# Altium project HHL_Control_board_Rev1.PrjPcb (part 1 of 2)
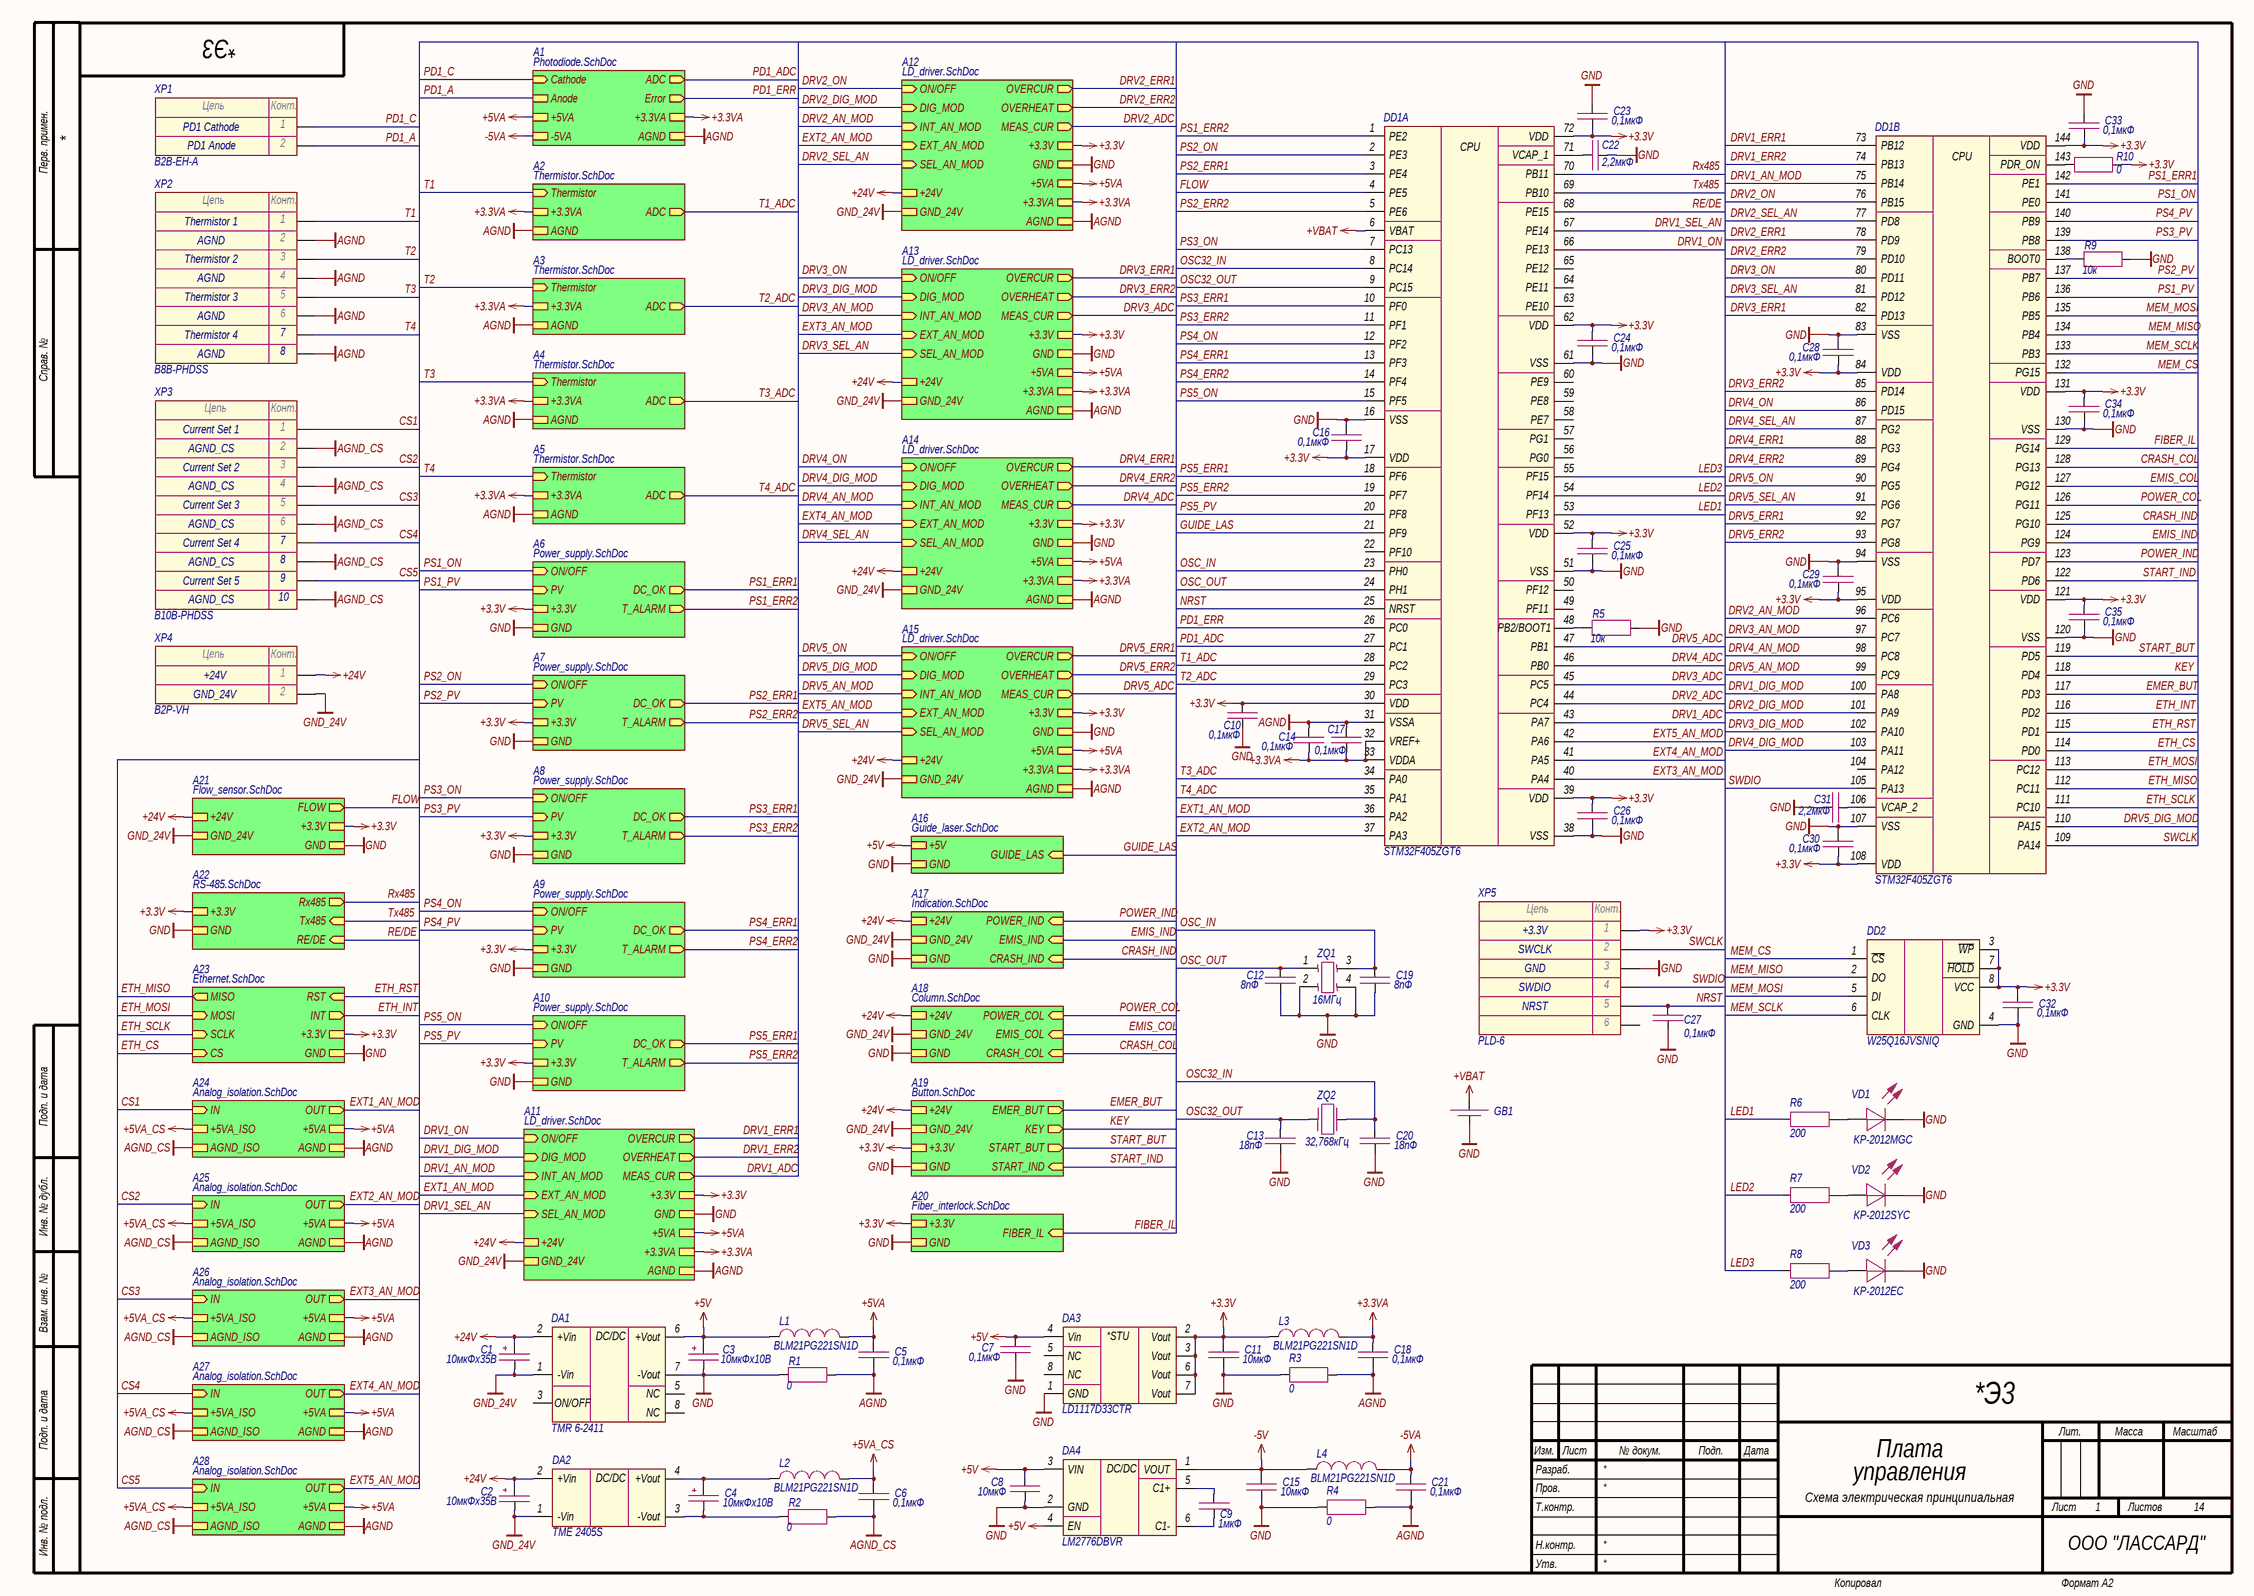
[diagram p0: Main.SchDoc]
14 sheets, 627 parts. Net scope: strictly hierarchical (ports join the sheet entries above them; power ports are local).
Board file: PCB1.PcbDoc
Sheets:
  Main.SchDoc
    A1 = Photodiode.SchDoc
    A5 = Thermistor.SchDoc
    A2 = Thermistor.SchDoc
    A3 = Thermistor.SchDoc
    A4 = Thermistor.SchDoc
    A6 = Power_supply.SchDoc
    A7 = Power_supply.SchDoc
    A8 = Power_supply.SchDoc
    A9 = Power_supply.SchDoc
    A10 = Power_supply.SchDoc
    A11 = LD_driver.SchDoc
    A12 = LD_driver.SchDoc
    A13 = LD_driver.SchDoc
    A14 = LD_driver.SchDoc
    A15 = LD_driver.SchDoc
    A16 = Guide_laser.SchDoc
    A17 = Indication.SchDoc
    A18 = Column.SchDoc
    A19 = Button.SchDoc
    A20 = Fiber_interlock.SchDoc
    A21 = Flow_sensor.SchDoc
    A22 = RS-485.SchDoc
    A23 = Ethernet.SchDoc
    A24 = Analog_isolation.SchDoc
    A25 = Analog_isolation.SchDoc
    A26 = Analog_isolation.SchDoc
    A27 = Analog_isolation.SchDoc
    A28 = Analog_isolation.SchDoc

## Sheet Main.SchDoc: Плата
size 594 x 420 mm; CompanyName: ООО "ЛАССАРД"; Address1: Address1; Address2: Address2; Address3: Address3; Address4: Address4; DocumentNumber: *Э3; SheetNumber: 1; SheetTotal: 14; Title2str: управления; DocumentType: Схема электрическая принципиальная

### Parts
C1  10мкФх35B  [CAP_C]
C2  10мкФх35B  [CAP_C]
C3  10мкФх10B  [CAP_A]
C4  10мкФх10B  [CAP_A]
C5  0,1мкФ  [CAP_0603]
C6  0,1мкФ  [CAP_0603]
C7  0,1мкФ  [CAP_0603]
C8  10мкФ  [CAP_0603]
C9  1мкФ  [CAP_0603]
C10  0,1мкФ  [CAP_0603]
C11  10мкФ  [CAP_0603]
C12  8пФ  [CAP_0603]
C13  18пФ  [CAP_0603]
C14  0,1мкФ  [CAP_0603]
C15  10мкФ  [CAP_0603]
C16  0,1мкФ  [CAP_0603]
C17  0,1мкФ  [CAP_0603]
C18  0,1мкФ  [CAP_0603]
C19  8пФ  [CAP_0603]
C20  18пФ  [CAP_0603]
C21  0,1мкФ  [CAP_0603]
C22  2,2мкФ  [CAP_0603]
C23  0,1мкФ  [CAP_0603]
C24  0,1мкФ  [CAP_0603]
C25  0,1мкФ  [CAP_0603]
C26  0,1мкФ  [CAP_0603]
C27  0,1мкФ  [CAP_0603]
C28  0,1мкФ  [CAP_0603]
C29  0,1мкФ  [CAP_0603]
C30  0,1мкФ  [CAP_0603]
C31  2,2мкФ  [CAP_0603]
C32  0,1мкФ  [CAP_0603]
C33  0,1мкФ  [CAP_0603]
C34  0,1мкФ  [CAP_0603]
C35  0,1мкФ  [CAP_0603]
DA1  TMR 6-2411  [TMR3 (SIP-8)]
DA2  TME 2405S  [TME (SIP-4)]
DA3  LD1117D33CTR  [SOIC-8]
DA4  LM2776DBVR  [SOT-23-6]
DD1  STM32F405ZGT6  [LQFP-144]  (parts A,B of 2)
DD2  W25Q16JVSNIQ  [SOIC-8]
GB1  DS1092-12-N8S  [DS1092-12-N8S]  (value not drawn)
L1  BLM21PG221SN1D  [IND_0805]
L2  BLM21PG221SN1D  [IND_0805]
L3  BLM21PG221SN1D  [IND_0805]
L4  BLM21PG221SN1D  [IND_0805]
R1  0  [RES_0805]
R2  0  [RES_0805]
R3  0  [RES_0805]
R4  0  [RES_0805]
R5  10к  [RES_0603]
R6  200  [RES_0603]
R7  200  [RES_0603]
R8  200  [RES_0603]
R9  10к  [RES_0603]
R10  0  [RES_0603]
VD1  KP-2012MGC  [LED_0805]
VD2  KP-2012SYC  [LED_0805]
VD3  KP-2012EC  [LED_0805]
XP1  B2B-EH-A  [B2B-EH-A]
XP2  B8B-PHDSS  [B8B-PHDSS]
XP3  B10B-PHDSS  [B10B-PHDSS]
XP4  B2P-VH  [B2P-VH]
XP5  PLD-6  [PLD-6]
ZQ1  16МГц  [NX2520SA]
ZQ2  32,768кГц  [NX3215SA]

### Sub-sheets
A1 = Photodiode.SchDoc: ADC (out), Error (out), AGND, +5VA, +3.3VA, Anode, -5VA, Cathode (in)
A2 = Thermistor.SchDoc: Thermistor (in), +3.3VA, AGND, ADC (out)
A3 = Thermistor.SchDoc: Thermistor (in), +3.3VA, AGND, ADC (out)
A4 = Thermistor.SchDoc: Thermistor (in), +3.3VA, AGND, ADC (out)
A5 = Thermistor.SchDoc: Thermistor (in), +3.3VA, AGND, ADC (out)
A6 = Power_supply.SchDoc: ON/OFF (in), PV (in), +3.3V, GND, DC_OK (out), T_ALARM (out)
A7 = Power_supply.SchDoc: ON/OFF (in), PV (in), +3.3V, GND, DC_OK (out), T_ALARM (out)
A8 = Power_supply.SchDoc: ON/OFF (in), PV (in), +3.3V, GND, DC_OK (out), T_ALARM (out)
A9 = Power_supply.SchDoc: ON/OFF (in), PV (in), +3.3V, GND, DC_OK (out), T_ALARM (out)
A10 = Power_supply.SchDoc: ON/OFF (in), PV (in), +3.3V, GND, DC_OK (out), T_ALARM (out)
A11 = LD_driver.SchDoc: +3.3V, GND, OVERCUR (out), OVERHEAT (out), +24V, GND_24V, ON/OFF (in), DIG_MOD (in), INT_AN_MOD (in), EXT_AN_MOD (in), SEL_AN_MOD (in), MEAS_CUR (out), +5VA, +3.3VA, AGND
A12 = LD_driver.SchDoc: +3.3V, GND, OVERCUR (out), OVERHEAT (out), +24V, GND_24V, ON/OFF (in), DIG_MOD (in), INT_AN_MOD (in), EXT_AN_MOD (in), SEL_AN_MOD (in), MEAS_CUR (out), +5VA, +3.3VA, AGND
A13 = LD_driver.SchDoc: +3.3V, GND, OVERCUR (out), OVERHEAT (out), +24V, GND_24V, ON/OFF (in), DIG_MOD (in), INT_AN_MOD (in), EXT_AN_MOD (in), SEL_AN_MOD (in), MEAS_CUR (out), +5VA, +3.3VA, AGND
A14 = LD_driver.SchDoc: +3.3V, GND, OVERCUR (out), OVERHEAT (out), +24V, GND_24V, ON/OFF (in), DIG_MOD (in), INT_AN_MOD (in), EXT_AN_MOD (in), SEL_AN_MOD (in), MEAS_CUR (out), +5VA, +3.3VA, AGND
A15 = LD_driver.SchDoc: +3.3V, GND, OVERCUR (out), OVERHEAT (out), +24V, GND_24V, ON/OFF (in), DIG_MOD (in), INT_AN_MOD (in), EXT_AN_MOD (in), SEL_AN_MOD (in), MEAS_CUR (out), +5VA, +3.3VA, AGND
A16 = Guide_laser.SchDoc: GUIDE_LAS (in), +5V, GND
A17 = Indication.SchDoc: GND_24V, +24V, CRASH_IND (in), POWER_IND (in), EMIS_IND (in), GND
A18 = Column.SchDoc: GND_24V, +24V, CRASH_COL (in), POWER_COL (in), EMIS_COL (in), GND
A19 = Button.SchDoc: EMER_BUT (out), +24V, GND_24V, +3.3V, GND, KEY (out), START_BUT (out), START_IND (in)
A20 = Fiber_interlock.SchDoc: FIBER_IL (in), +3.3V, GND
A21 = Flow_sensor.SchDoc: FLOW (out), +24V, GND_24V, +3.3V, GND
A22 = RS-485.SchDoc: Rx485 (out), Tx485 (in), RE/DE (in), +3.3V, GND
A23 = Ethernet.SchDoc: MISO (out), RST (in), MOSI (in), INT (out), SCLK (in), CS (in), +3.3V, GND
A24 = Analog_isolation.SchDoc: IN (in), +5VA_ISO, AGND_ISO, OUT (out), AGND, +5VA
A25 = Analog_isolation.SchDoc: IN (in), +5VA_ISO, AGND_ISO, OUT (out), AGND, +5VA
A26 = Analog_isolation.SchDoc: IN (in), +5VA_ISO, AGND_ISO, OUT (out), AGND, +5VA
A27 = Analog_isolation.SchDoc: IN (in), +5VA_ISO, AGND_ISO, OUT (out), AGND, +5VA
A28 = Analog_isolation.SchDoc: IN (in), +5VA_ISO, AGND_ISO, OUT (out), +5VA, AGND

### Nets
+3.3V: C10.1 C11.1 C16.2 C23.2 C24.1 C25.1 C26.1 C28.2 C29.2 C30.2 C32.1 C33.2 C34.1 C35.1 DA3.2(Vout) DA3.3(Vout) DA3.6(Vout) DA3.7(Vout) DD1.17(VDD) DD1.30(VDD) DD1.39(VDD) DD1.52(VDD) DD1.62(VDD) DD1.72(VDD) DD1.84(VDD) DD1.95(VDD) DD1.108(VDD) DD1.121(VDD) DD1.131(VDD) DD1.144(VDD) DD2.3(~{WP}) DD2.7(~{HOLD}) DD2.8(VCC) L3.1 R10.2 XP5.1 ; sheet A6/+3.3V, sheet A7/+3.3V, sheet A8/+3.3V, sheet A9/+3.3V, sheet A10/+3.3V, sheet A11/+3.3V, sheet A12/+3.3V, sheet A13/+3.3V, sheet A14/+3.3V, sheet A15/+3.3V, sheet A19/+3.3V, sheet A20/+3.3V, sheet A21/+3.3V, sheet A22/+3.3V, sheet A23/+3.3V
+3.3VA: C14.2 C17.2 C18.1 DD1.32(VREF+) DD1.33(VDDA) L3.2 ; sheet A1/+3.3VA, sheet A5/+3.3VA, sheet A2/+3.3VA, sheet A3/+3.3VA, sheet A4/+3.3VA, sheet A11/+3.3VA, sheet A12/+3.3VA, sheet A13/+3.3VA, sheet A14/+3.3VA, sheet A15/+3.3VA
+5V: C3.1 C7.2 C8.1 DA1.6(+Vout) DA3.4(Vin) DA4.3(VIN) DA4.4(EN) L1.1 ; sheet A16/+5V
+5VA: C5.1 L1.2 ; sheet A1/+5VA, sheet A11/+5VA, sheet A12/+5VA, sheet A13/+5VA, sheet A14/+5VA, sheet A15/+5VA, sheet A24/+5VA, sheet A25/+5VA, sheet A26/+5VA, sheet A27/+5VA, sheet A28/+5VA
+5VA_CS: C6.1 L2.2 ; sheet A24/+5VA_ISO, sheet A25/+5VA_ISO, sheet A26/+5VA_ISO, sheet A27/+5VA_ISO, sheet A28/+5VA_ISO
+24V: C1.1 C2.1 DA1.2(+Vin) DA2.2(+Vin) XP4.1 ; sheet A11/+24V, sheet A12/+24V, sheet A13/+24V, sheet A14/+24V, sheet A15/+24V, sheet A17/+24V, sheet A18/+24V, sheet A19/+24V, sheet A21/+24V
+VBAT: DD1.6(VBAT) GB1.2
-5V: C15.1 DA4.1(VOUT) L4.1
-5VA: C21.1 L4.2 ; sheet A1/-5VA
AGND: C5.2 C14.1 C17.1 C18.2 C21.2 DD1.31(VSSA) R1.2 R3.2 R4.2 XP2.2 XP2.4 XP2.6 XP2.8 ; sheet A1/AGND, sheet A5/AGND, sheet A2/AGND, sheet A3/AGND, sheet A4/AGND, sheet A11/AGND, sheet A12/AGND, sheet A13/AGND, sheet A14/AGND, sheet A15/AGND, sheet A24/AGND, sheet A25/AGND, sheet A26/AGND, sheet A27/AGND, sheet A28/AGND
AGND_CS: C6.2 R2.2 XP3.2 XP3.4 XP3.6 XP3.8 XP3.10 ; sheet A24/AGND_ISO, sheet A25/AGND_ISO, sheet A26/AGND_ISO, sheet A27/AGND_ISO, sheet A28/AGND_ISO
GND: C3.2 C7.1 C8.2 C10.2 C11.2 C12.2 C13.2 C15.2 C16.1 C19.2 C20.2 C22.2 C23.1 C24.2 C25.2 C26.2 C27.2 C28.1 C29.1 C30.1 C31.2 C32.2 C33.1 C34.2 C35.2 DA1.7(-Vout) DA3.1(GND) DA4.2(GND) DD1.16(VSS) DD1.38(VSS) DD1.51(VSS) DD1.61(VSS) DD1.83(VSS) DD1.94(VSS) DD1.107(VSS) DD1.120(VSS) DD1.130(VSS) DD2.4(GND) GB1.1 R1.1 R3.1 R4.1 R5.2 R9.2 VD1.2(C) VD2.2(C) VD3.2(C) XP5.3 ZQ1.2 ZQ1.4 ; sheet A6/GND, sheet A7/GND, sheet A8/GND, sheet A9/GND, sheet A10/GND, sheet A11/GND, sheet A12/GND, sheet A13/GND, sheet A14/GND, sheet A15/GND, sheet A16/GND, sheet A17/GND, sheet A18/GND, sheet A19/GND, sheet A20/GND, sheet A21/GND, sheet A22/GND, sheet A23/GND
GND_24V: C1.2 C2.2 DA1.1(-Vin) DA2.1(-Vin) XP4.2 ; sheet A11/GND_24V, sheet A12/GND_24V, sheet A13/GND_24V, sheet A14/GND_24V, sheet A15/GND_24V, sheet A17/GND_24V, sheet A18/GND_24V, sheet A19/GND_24V, sheet A21/GND_24V
CRASH_COL: DD1.128(PG13) ; sheet A18/CRASH_COL
CRASH_IND: DD1.125(PG10) ; sheet A17/CRASH_IND
CS1: XP3.1 ; sheet A24/IN
CS2: XP3.3 ; sheet A25/IN
CS3: XP3.5 ; sheet A26/IN
CS4: XP3.7 ; sheet A27/IN
CS5: XP3.9 ; sheet A28/IN
DRV1_ADC: DD1.43(PA7) ; sheet A11/MEAS_CUR
DRV1_AN_MOD: DD1.75(PB14) ; sheet A11/INT_AN_MOD
DRV1_DIG_MOD: DD1.100(PA8) ; sheet A11/DIG_MOD
DRV1_ERR1: DD1.73(PB12) ; sheet A11/OVERCUR
DRV1_ERR2: DD1.74(PB13) ; sheet A11/OVERHEAT
DRV1_ON: DD1.66(PE13) ; sheet A11/ON/OFF
DRV1_SEL_AN: DD1.67(PE14) ; sheet A11/SEL_AN_MOD
DRV2_ADC: DD1.44(PC4) ; sheet A12/MEAS_CUR
DRV2_AN_MOD: DD1.96(PC6) ; sheet A12/INT_AN_MOD
DRV2_DIG_MOD: DD1.101(PA9) ; sheet A12/DIG_MOD
DRV2_ERR1: DD1.78(PD9) ; sheet A12/OVERCUR
DRV2_ERR2: DD1.79(PD10) ; sheet A12/OVERHEAT
DRV2_ON: DD1.76(PB15) ; sheet A12/ON/OFF
DRV2_SEL_AN: DD1.77(PD8) ; sheet A12/SEL_AN_MOD
DRV3_ADC: DD1.45(PC5) ; sheet A13/MEAS_CUR
DRV3_AN_MOD: DD1.97(PC7) ; sheet A13/INT_AN_MOD
DRV3_DIG_MOD: DD1.102(PA10) ; sheet A13/DIG_MOD
DRV3_ERR1: DD1.82(PD13) ; sheet A13/OVERCUR
DRV3_ERR2: DD1.85(PD14) ; sheet A13/OVERHEAT
DRV3_ON: DD1.80(PD11) ; sheet A13/ON/OFF
DRV3_SEL_AN: DD1.81(PD12) ; sheet A13/SEL_AN_MOD
DRV4_ADC: DD1.46(PB0) ; sheet A14/MEAS_CUR
DRV4_AN_MOD: DD1.98(PC8) ; sheet A14/INT_AN_MOD
DRV4_DIG_MOD: DD1.103(PA11) ; sheet A14/DIG_MOD
DRV4_ERR1: DD1.88(PG3) ; sheet A14/OVERCUR
DRV4_ERR2: DD1.89(PG4) ; sheet A14/OVERHEAT
DRV4_ON: DD1.86(PD15) ; sheet A14/ON/OFF
DRV4_SEL_AN: DD1.87(PG2) ; sheet A14/SEL_AN_MOD
DRV5_ADC: DD1.47(PB1) ; sheet A15/MEAS_CUR
DRV5_AN_MOD: DD1.99(PC9) ; sheet A15/INT_AN_MOD
DRV5_DIG_MOD: DD1.110(PA15) ; sheet A15/DIG_MOD
DRV5_ERR1: DD1.92(PG7) ; sheet A15/OVERCUR
DRV5_ERR2: DD1.93(PG8) ; sheet A15/OVERHEAT
DRV5_ON: DD1.90(PG5) ; sheet A15/ON/OFF
DRV5_SEL_AN: DD1.91(PG6) ; sheet A15/SEL_AN_MOD
EMER_BUT: DD1.117(PD3) ; sheet A19/EMER_BUT
EMIS_COL: DD1.127(PG12) ; sheet A18/EMIS_COL
EMIS_IND: DD1.124(PG9) ; sheet A17/EMIS_IND
ETH_CS: DD1.114(PD0) ; sheet A23/CS
ETH_INT: DD1.116(PD2) ; sheet A23/INT
ETH_MISO: DD1.112(PC11) ; sheet A23/MISO
ETH_MOSI: DD1.113(PC12) ; sheet A23/MOSI
ETH_RST: DD1.115(PD1) ; sheet A23/RST
ETH_SCLK: DD1.111(PC10) ; sheet A23/SCLK
EXT1_AN_MOD: DD1.36(PA2) ; sheet A11/EXT_AN_MOD, sheet A24/OUT
EXT2_AN_MOD: DD1.37(PA3) ; sheet A12/EXT_AN_MOD, sheet A25/OUT
EXT3_AN_MOD: DD1.40(PA4) ; sheet A13/EXT_AN_MOD, sheet A26/OUT
EXT4_AN_MOD: DD1.41(PA5) ; sheet A14/EXT_AN_MOD, sheet A27/OUT
EXT5_AN_MOD: DD1.42(PA6) ; sheet A15/EXT_AN_MOD, sheet A28/OUT
FIBER_IL: DD1.129(PG14) ; sheet A20/FIBER_IL
FLOW: DD1.4(PE5) ; sheet A21/FLOW
GUIDE_LAS: DD1.21(PF9) ; sheet A16/GUIDE_LAS
KEY: DD1.118(PD4) ; sheet A19/KEY
LED1: DD1.53(PF13) R6.1
LED2: DD1.54(PF14) R7.1
LED3: DD1.55(PF15) R8.1
MEM_CS: DD1.132(PG15) DD2.1(~{CS})
MEM_MISO: DD1.134(PB4) DD2.2(DO)
MEM_MOSI: DD1.135(PB5) DD2.5(DI)
MEM_SCLK: DD1.133(PB3) DD2.6(CLK)
NRST: C27.1 DD1.25(NRST) XP5.5
OSC32_IN: C20.1 DD1.8(PC14) ZQ2.2
OSC32_OUT: C13.1 DD1.9(PC15) ZQ2.1
OSC_IN: C19.1 DD1.23(PH0) ZQ1.3
OSC_OUT: C12.1 DD1.24(PH1) ZQ1.1
PD1_A: XP1.2 ; sheet A1/Anode
PD1_ADC: DD1.27(PC1) ; sheet A1/ADC
PD1_C: XP1.1 ; sheet A1/Cathode
PD1_ERR: DD1.26(PC0) ; sheet A1/Error
POWER_COL: DD1.126(PG11) ; sheet A18/POWER_COL
POWER_IND: DD1.123(PD7) ; sheet A17/POWER_IND
PS1_ERR1: DD1.142(PE1) ; sheet A6/DC_OK
PS1_ERR2: DD1.1(PE2) ; sheet A6/T_ALARM
PS1_ON: DD1.141(PE0) ; sheet A6/ON/OFF
PS1_PV: DD1.136(PB6) ; sheet A6/PV
PS2_ERR1: DD1.3(PE4) ; sheet A7/DC_OK
PS2_ERR2: DD1.5(PE6) ; sheet A7/T_ALARM
PS2_ON: DD1.2(PE3) ; sheet A7/ON/OFF
PS2_PV: DD1.137(PB7) ; sheet A7/PV
PS3_ERR1: DD1.10(PF0) ; sheet A8/DC_OK
PS3_ERR2: DD1.11(PF1) ; sheet A8/T_ALARM
PS3_ON: DD1.7(PC13) ; sheet A8/ON/OFF
PS3_PV: DD1.139(PB8) ; sheet A8/PV
PS4_ERR1: DD1.13(PF3) ; sheet A9/DC_OK
PS4_ERR2: DD1.14(PF4) ; sheet A9/T_ALARM
PS4_ON: DD1.12(PF2) ; sheet A9/ON/OFF
PS4_PV: DD1.140(PB9) ; sheet A9/PV
PS5_ERR1: DD1.18(PF6) ; sheet A10/DC_OK
PS5_ERR2: DD1.19(PF7) ; sheet A10/T_ALARM
PS5_ON: DD1.15(PF5) ; sheet A10/ON/OFF
PS5_PV: DD1.20(PF8) ; sheet A10/PV
RE/DE: DD1.68(PE15) ; sheet A22/RE/DE
Rx485: DD1.70(PB11) ; sheet A22/Rx485
START_BUT: DD1.119(PD5) ; sheet A19/START_BUT
START_IND: DD1.122(PD6) ; sheet A19/START_IND
SWCLK: DD1.109(PA14) XP5.2
SWDIO: DD1.105(PA13) XP5.4
T1: XP2.1 ; sheet A2/Thermistor
T1_ADC: DD1.28(PC2) ; sheet A2/ADC
T2: XP2.3 ; sheet A3/Thermistor
T2_ADC: DD1.29(PC3) ; sheet A3/ADC
T3: XP2.5 ; sheet A4/Thermistor
T3_ADC: DD1.34(PA0) ; sheet A4/ADC
T4: XP2.7 ; sheet A5/Thermistor
T4_ADC: DD1.35(PA1) ; sheet A5/ADC
Tx485: DD1.69(PB10) ; sheet A22/Tx485
NetC4_1: C4.1 DA2.4(+Vout) L2.1
NetC4_2: C4.2 DA2.3(-Vout) R2.1
NetC9_1: C9.1 DA4.5(C1+)
NetC9_2: C9.2 DA4.6(C1-)
NetC22_1: C22.1 DD1.71(VCAP_1)
NetC31_1: C31.1 DD1.106(VCAP_2)
NetDD1_48: DD1.48(PB2/BOOT1) R5.1
NetDD1_138: DD1.138(BOOT0) R9.1
NetDD1_143: DD1.143(PDR_ON) R10.1
NetR6_2: R6.2 VD1.1(A)
NetR7_2: R7.2 VD2.1(A)
NetR8_2: R8.2 VD3.1(A)

Not connected (* = marked no-connect by the designer): DA1 3(ON/OFF) 5(NC) 8(NC); DA3 5(NC) 8(NC); DD1 22(PF10) 49(PF11) 50(PF12) 56(PG0) 57(PG1) 58(PE7) 59(PE8) 60(PE9) 63(PE10) 64(PE11) 65(PE12) 104(PA12); XP5 6

### Notes on the sheet
- PD1 Cathode
- PD1 Anode
- Thermistor 1
- AGND
- Thermistor 2
- Thermistor 3
- Thermistor 4
- Current Set 1
- AGND_CS
- Current Set 2
- Current Set 3
- Current Set 4
- Current Set 5
- +24V
- GND_24V
- +3.3V
- GND
- SWDIO
- SWCLK
- NRST
- Перв. примен.
- Справ. №
- Подп. и дата
- Инв. № дубл.
- Взам. инв. №
- Разраб.
- Изм.
- Лист
- № докум.
- Подп.
- Дата
- Лит.
- Масса
- Масштаб
- Пров.
- Т.контр.
- Листов
- Инв. № подл.
- Утв.
- Н.контр.
- Копировал
- Формат А2
- (in symbol Connector-2) Цепь; Конт.
- (in symbol Connector-8) Цепь; Конт.
- (in symbol Connector-10) Цепь; Конт.
- (in symbol LD1117D33) *STU
- (in symbol LM2776DBVR) DC/DC
- (in symbol STM32F405ZG, part A) CPU
- (in symbol STM32F405ZG, part B) CPU
- (in symbol TME) DC/DC
- (in symbol TMR3) DC/DC

### Library data of the parts
C1 C2 = Capacitor_Polar: Model: TECAP, 10 мкФ, 35 В, тип C, 10%; Value: 10мкФх35B; Document: *; Manufacturer: *
C3 C4 = Capacitor_Polar: Model: TECAP, 10 мкФ, 10 В, тип A, 10%; Value: 10мкФх10B; Document: *; Manufacturer: *
C5-C7 C10 C14 C16-C18 C21 C23-C30 C32-C35 = Capacitor: Manufacturer: Murata; Model: GRM188R71H104KA93D; Value: 0,1мкФ; Document: *
C8 C11 C15 = Capacitor: Manufacturer: Murata; Model: GRM188R61E106KA73D; Value: 10мкФ; Document: *
C9 = Capacitor: Manufacturer: Murata; Model: GRM188R61H105KAALD; Value: 1мкФ; Document: *
C12 C19 = Capacitor: Manufacturer: Yageo; Model: CC0603CRNPO9BN8R0; Value: 8пФ; Document: *
C13 C20 = Capacitor: Manufacturer: Murata; Model: GRM1885C1H180FA01D; Value: 18пФ; Document: *
C22 C31 = Capacitor: Manufacturer: Murata; Model: GRM188R61H225KE11D; Value: 2,2мкФ; Document: *
DA1 = TMR3: Manufacturer: Traco Power; Model: TMR 6-2411; Document: *
DA2 = TME: Manufacturer: Traco Power; Model: TME 2405S; Document: *
DA3 = LD1117D33: Manufacturer: STMicroelectronics; Model: LD1117D33CTR; Document: *
DA4 = LM2776DBVR: Manufacturer: Texas Instruments; Model: LM2776DBVR; Document: *
DD1 = STM32F405ZG: Manufacturer: STMicroelectronics; Model: STM32F405ZGT6; Document: *
DD2 = W25Q: Manufacturer: Winbond; Model: W25Q16JVSNIQ; Document: *
GB1 = Accumulator: Manufacturer: Connfly; Model: DS1092-12-N8S; Document: *
L1-L4 = Inductor: Manufacturer: Murata; Value: *; Model: BLM21PG221SN1D; Document: *
R1-R4 = Resistor: Manufacturer: Yageo; Model: RC0805FR-070RL; Value: 0; Document: *
R5 R9 = Resistor: Manufacturer: Yageo; Model: RC0603FR-0710KL; Value: 10к; Document: *
R6-R8 = Resistor: Manufacturer: Yageo; Model: RC0603FR-07200RL; Value: 200; Document: *
R10 = Resistor: Manufacturer: Yageo; Model: RC0603FR-070RL; Value: 0; Document: *
VD1-VD3 = LED: Manufacturer: Kingbright; Document: *
  VD1: Model: KP-2012MGC
  VD2: Model: KP-2012SYC
  VD3: Model: KP-2012EC
XP1 XP4 = Connector-2: Manufacturer: JST; Document: *
  XP1: Model: B2B-EH-A
  XP4: Model: B2P-VH
XP2 = Connector-8: Manufacturer: JST; Model: B8B-PHDSS; Document: *
XP3 = Connector-10: Manufacturer: JST; Model: B10B-PHDSS; Document: *
XP5 = Connector-6: Manufacturer: Connfly; Model: PLD-6; Document: *
ZQ1 = Quartz_Resonator_4-pin: Manufacturer: NDK; Model: NX2520SA-16MHZ-STD-CSW-5; Value: 16МГц; Document: *
ZQ2 = Quartz_Resonator: Manufacturer: NDK; Model: NX3215SA- 32.768K-STD-MUA-8; Value: 32,768кГц; Document: *

## Sheet Photodiode.SchDoc
size 420 x 297 mm; Address1: Address1; Address2: Address2; Address3: Address3; Address4: Address4; DocumentNumber: *Э3; SheetNumber: 2; SheetTotal: 14; DocumentType: Схема электрическая *
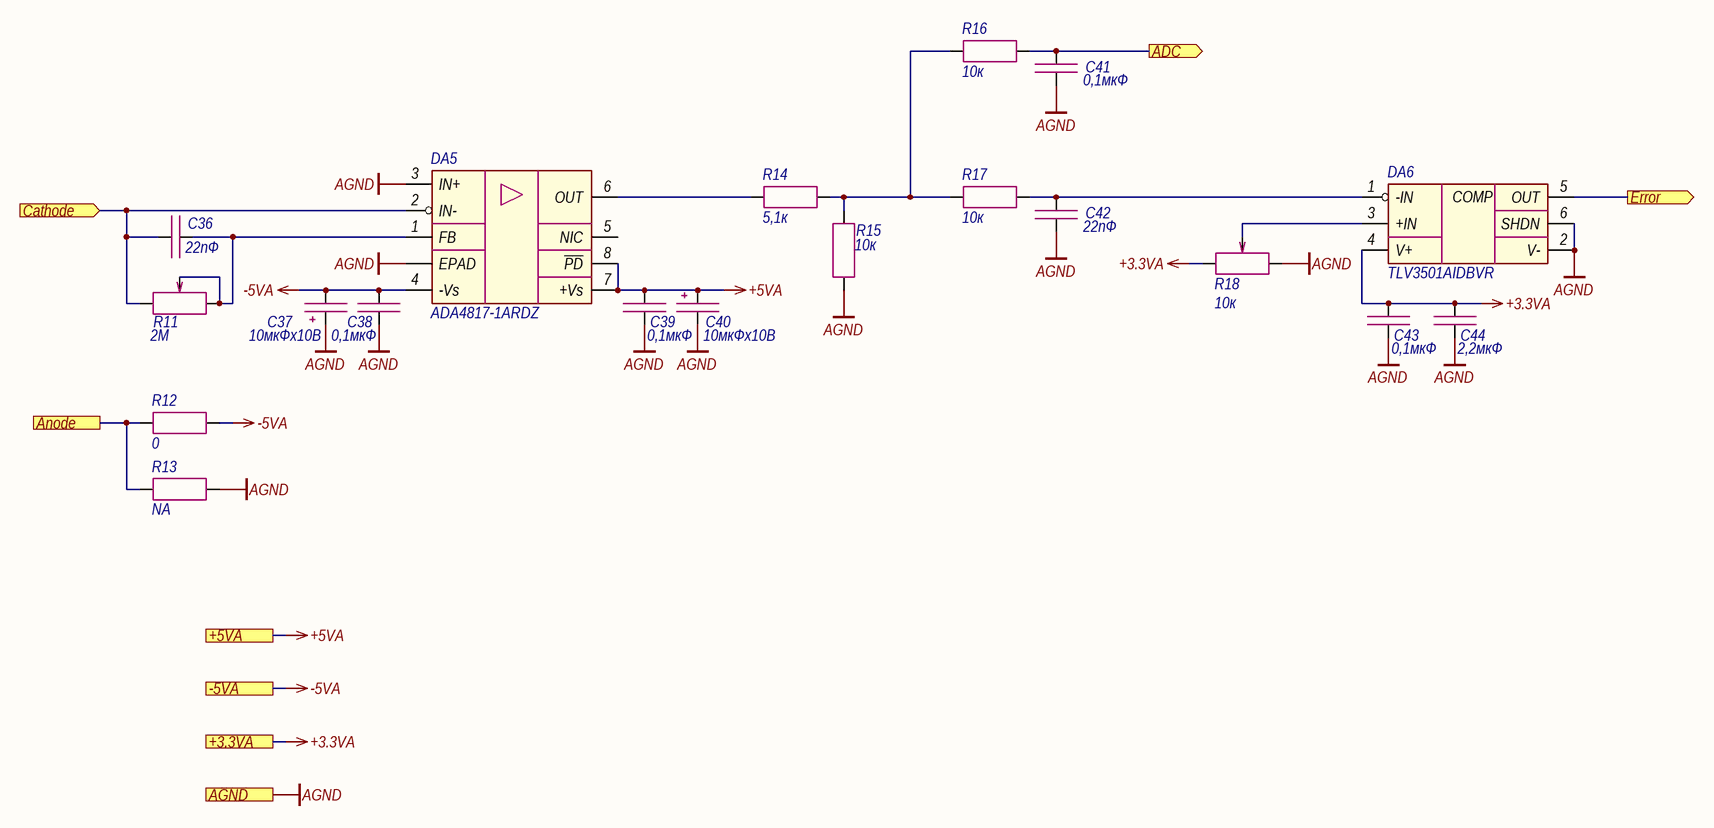
[diagram p1: Photodiode.SchDoc]

### Parts
C36  22пФ  [CAP_0603]
C37  10мкФх10B  [CAP_A]
C38  0,1мкФ  [CAP_0603]
C39  0,1мкФ  [CAP_0603]
C40  10мкФх10B  [CAP_A]
C41  0,1мкФ  [CAP_0603]
C42  22пФ  [CAP_0603]
C43  0,1мкФ  [CAP_0603]
C44  2,2мкФ  [CAP_0603]
DA5  ADA4817-1ARDZ  [SOIC-8 EPAD]
DA6  TLV3501AIDBVR  [SOT-23-6]
R11  2М  [3224W]
R12  0  [RES_0603]
R13  NA  [RES_0603]
R14  5,1к  [RES_0603]
R15  10к  [RES_0603]
R16  10к  [RES_0603]
R17  10к  [RES_0603]
R18  10к  [3224W]

### Ports
+3.3VA (see Main[2A], LD_driver[1D], Thermistor[2C]), +5VA (see Main[1A], Analog_isolation[2C], LD_driver[1D]), -5VA (see Main[1A]), ADC (out, see Main[2A]), AGND (see Main[2A], Analog_isolation[2C], LD_driver[1D], Thermistor[2C]), Anode (see Main[1A]), Cathode (in, see Main[1A]), Error (out, see Main[2A])

### Nets
+3.3VA: C43.1 C44.1 DA6.4(V+) R18.3 ; port +3.3VA
+5VA: C39.1 C40.1 DA5.7(+Vs) DA5.8(~{PD}) ; port +5VA
-5VA: C37.2 C38.1 DA5.4(-Vs) R12.1 ; port -5VA
AGND: C37.1 C38.2 C39.2 C40.2 C41.2 C42.2 C43.2 C44.2 DA5.3(IN+) DA5.EPAD DA6.2(V-) DA6.6(SHDN) R13.2 R15.2 R18.1 ; port AGND
PD1_A: R12.2 R13.1 ; port Anode
PD1_ADC: C41.1 R16.2 ; port ADC
PD1_C: C36.2 DA5.2(IN-) R11.1 ; port Cathode
PD1_ERR: DA6.5(OUT) ; port Error
NetC36_1: C36.1 DA5.1(FB) R11.2 R11.3
NetC42_1: C42.1 DA6.1(-IN) R17.2
NetDA5_6: DA5.6(OUT) R14.1
NetDA6_3: DA6.3(+IN) R18.2
NetR14_2: R14.2 R15.1 R16.1 R17.1

Not connected (* = marked no-connect by the designer): DA5 5(NIC)

### Notes on the sheet
- Подп. и дата
- Инв. № дубл.
- Взам. инв. №
- Инв. № подл.
- Изм.
- Лист
- № докум.
- Подп.
- Дата
- Копировал
- Формат А3
- (in symbol TLV3501) COMP

### Library data of the parts
C36 C42 = Capacitor: Manufacturer: Murata; Model: GRM1885C1H220JA01D; Value: 22пФ; Document: *
C37 C40 = Capacitor_Polar: Model: TECAP, 10 мкФ, 10 В, тип A, 10%; Value: 10мкФх10B; Document: *; Manufacturer: *
C38 C39 C41 C43 = Capacitor: as C5 on sheet Main; Value: 0,1мкФ; Document: *
C44 = Capacitor: as C22 on sheet Main; Value: 2,2мкФ; Document: *
DA5 = ADA4817-1ARDZ: Manufacturer: Analog Devices; Model: ADA4817-1ARDZ; Document: *
DA6 = TLV3501: Manufacturer: Texas Instruments; Model: TLV3501AIDBVR; Document: *
R11 = Resistor_Variable: Manufacturer: Bourns; Model: 3224W-1-205; Value: 2М; Document: *
R12 = Resistor: as R10 on sheet Main; Value: 0; Document: *
R13 = Resistor: Value: NA; Model: *; Document: *; Manufacturer: *
R14 = Resistor: Manufacturer: Yageo; Model: RC0603FR-075K1L; Value: 5,1к; Document: *
R15-R17 = Resistor: as R5 on sheet Main; Value: 10к; Document: *
R18 = Resistor_Variable: Manufacturer: Bourns; Model: 3224W-1-103; Value: 10к; Document: *

## Sheet Thermistor.SchDoc
size 209 x 297 mm; Address1: Address1; Address2: Address2; Address3: Address3; Address4: Address4; DocumentNumber: *Э3; SheetNumber: 3; SheetTotal: 14; DocumentType: Схема электрическая *
Used 4 times, as channels A5, A2, A3, A4. Parts and nets are listed once, with the designators drawn on the sheet.
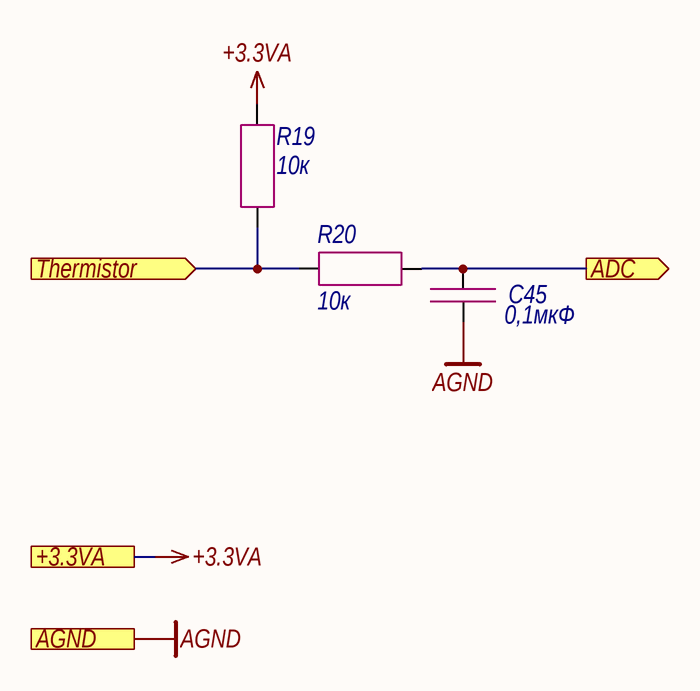
[diagram p2: Thermistor.SchDoc]

### Parts
C45  0,1мкФ  [CAP_0603]
R19  10к  [RES_0603]
R20  10к  [RES_0603]

### Ports
+3.3VA (see Main[1A], LD_driver[1D], Photodiode[1C]), ADC (out, see Main[2A]), AGND (see Main[1A], Analog_isolation[2C], LD_driver[1D], Photodiode[1D]), Thermistor (in, see Main[1A])

### Nets
+3.3VA: R19.1 ; port +3.3VA
AGND: C45.2 ; port AGND
ADC: C45.1 R20.2 ; port ADC
Thermistor: R19.2 R20.1 ; port Thermistor

### Channels
A5: designators end in A5; ports +3.3VA=+3.3VA ADC=T4_ADC AGND=AGND Thermistor=T4
A2: designators end in A2; ports +3.3VA=+3.3VA ADC=T1_ADC AGND=AGND Thermistor=T1
A3: designators end in A3; ports +3.3VA=+3.3VA ADC=T2_ADC AGND=AGND Thermistor=T2
A4: designators end in A4; ports +3.3VA=+3.3VA ADC=T3_ADC AGND=AGND Thermistor=T3

### Notes on the sheet
- Подп. и дата
- Инв. № дубл.
- Взам. инв. №
- Инв. № подл.
- Изм.
- Лист
- № докум.
- Подп.
- Дата
- Копировал
- Формат А4

### Library data of the parts
C45 = Capacitor: as C5 on sheet Main; Value: 0,1мкФ; Document: *
R19 R20 = Resistor: as R5 on sheet Main; Value: 10к; Document: *

## Sheet Power_supply.SchDoc
size 420 x 297 mm; Address1: Address1; Address2: Address2; Address3: Address3; Address4: Address4; DocumentNumber: *Э3; SheetNumber: 4; SheetTotal: 14; DocumentType: Схема электрическая *
Used 5 times, as channels A6, A7, A8, A9, A10. Parts and nets are listed once, with the designators drawn on the sheet.
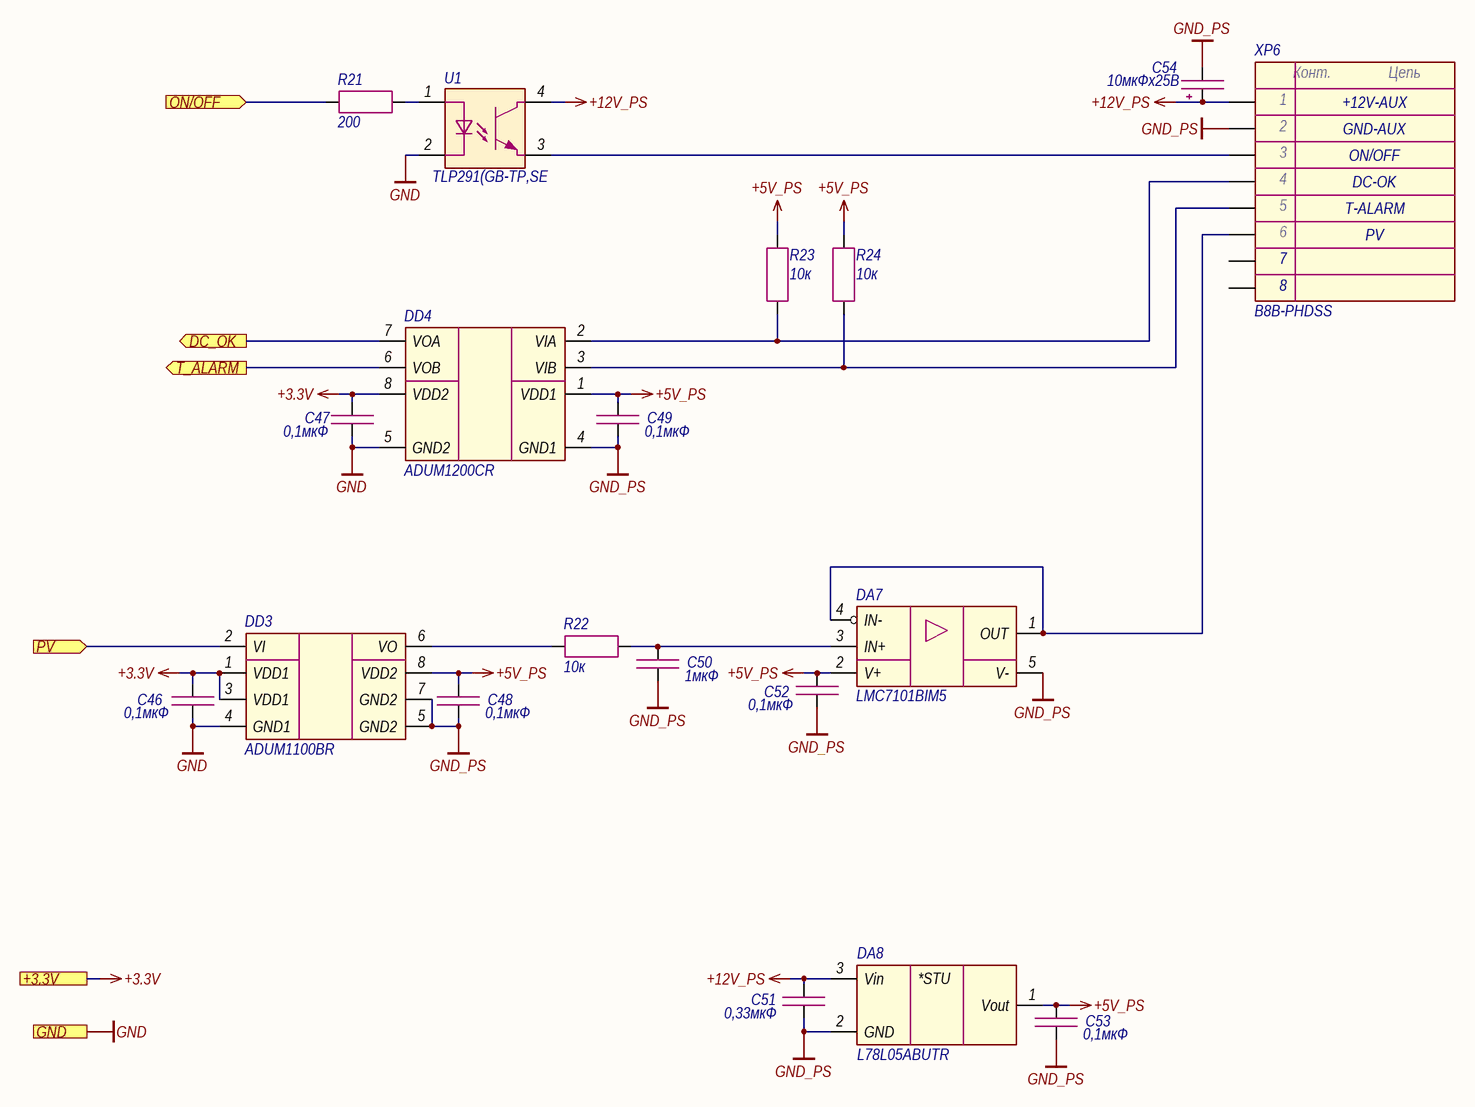
[diagram p3: Power_supply.SchDoc]

### Parts
C46  0,1мкФ  [CAP_0603]
C47  0,1мкФ  [CAP_0603]
C48  0,1мкФ  [CAP_0603]
C49  0,1мкФ  [CAP_0603]
C50  1мкФ  [CAP_0603]
C51  0,33мкФ  [CAP_0805]
C52  0,1мкФ  [CAP_0603]
C53  0,1мкФ  [CAP_0603]
C54  10мкФх25B  [CAP_B]
DA7  LMC7101BIM5  [SOT-23-5]
DA8  L78L05ABUTR  [SOT-89]
DD3  ADUM1100BR  [SOIC-8]
DD4  ADUM1200CR  [SOIC-8]
R21  200  [RES_0603]
R22  10к  [RES_0603]
R23  10к  [RES_0603]
R24  10к  [RES_0603]
U1  TLP291(GB-TP,SE  [11-3C1]
XP6  B8B-PHDSS  [B8B-PHDSS]

### Ports
+3.3V (see Main[1B], Button[1D], Ethernet[3D], Fiber_interlock[2C], Flow_sensor[2C], LD_driver[1D], RS-485[2C]), DC_OK (out, see Main[2B]), GND (see Main[1B], Button[1D], Column[1C], Ethernet[3D], Fiber_interlock[2C], Flow_sensor[2C], Guide_laser[1C], Indication[1C], LD_driver[1D], RS-485[2C]), ON/OFF (in, see Main[1B]), PV (in, see Main[1B]), T_ALARM (out, see Main[2B])

### Nets
+3.3V: C46.1 C47.1 DD3.1(VDD1) DD3.3(VDD1) DD4.8(VDD2) ; port +3.3V
+5V_PS: C48.1 C49.1 C52.1 C53.1 DA7.2(V+) DA8.1(Vout) DD3.8(VDD2) DD4.1(VDD1) R23.1 R24.1
+12V_PS: C51.2 C54.1 DA8.3(Vin) U1.4 XP6.1
GND: C46.2 C47.2 DD3.4(GND1) DD4.5(GND2) U1.2 ; port GND
GND_PS: C48.2 C49.2 C50.2 C51.1 C52.2 C53.2 C54.2 DA7.5(V-) DA8.2(GND) DD3.5(GND2) DD3.7(GND2) DD4.4(GND1) XP6.2
DC_OK: DD4.7(VOA) ; port DC_OK
ON/OFF: R21.1 ; port ON/OFF
PV: DD3.2(VI) ; port PV
T_ALARM: DD4.6(VOB) ; port T_ALARM
NetC50_1: C50.1 DA7.3(IN+) R22.2
NetDA7_1: DA7.1(OUT) DA7.4(IN-) XP6.6
NetDD3_6: DD3.6(VO) R22.1
NetDD4_2: DD4.2(VIA) R23.2 XP6.4
NetDD4_3: DD4.3(VIB) R24.2 XP6.5
NetR21_2: R21.2 U1.1
NetU1_3: U1.3 XP6.3

Not connected (* = marked no-connect by the designer): XP6 7 8

### Channels
A6: designators end in A6; ports +3.3V=+3.3V DC_OK=PS1_ERR1 GND=GND ON/OFF=PS1_ON PV=PS1_PV T_ALARM=PS1_ERR2
A7: designators end in A7; ports +3.3V=+3.3V DC_OK=PS2_ERR1 GND=GND ON/OFF=PS2_ON PV=PS2_PV T_ALARM=PS2_ERR2
A8: designators end in A8; ports +3.3V=+3.3V DC_OK=PS3_ERR1 GND=GND ON/OFF=PS3_ON PV=PS3_PV T_ALARM=PS3_ERR2
A9: designators end in A9; ports +3.3V=+3.3V DC_OK=PS4_ERR1 GND=GND ON/OFF=PS4_ON PV=PS4_PV T_ALARM=PS4_ERR2
A10: designators end in A10; ports +3.3V=+3.3V DC_OK=PS5_ERR1 GND=GND ON/OFF=PS5_ON PV=PS5_PV T_ALARM=PS5_ERR2

### Notes on the sheet
- +12V-AUX
- DC-OK
- ON/OFF
- GND-AUX
- T-ALARM
- PV
- Подп. и дата
- Инв. № дубл.
- Взам. инв. №
- Инв. № подл.
- Изм.
- Лист
- № докум.
- Подп.
- Дата
- Копировал
- Формат А3
- (in symbol Connector-8) Конт.; Цепь
- (in symbol LD2981ABU50TR) *STU

### Library data of the parts
C46-C49 C52 C53 = Capacitor: as C5 on sheet Main; Value: 0,1мкФ; Document: *
C50 = Capacitor: as C9 on sheet Main; Value: 1мкФ; Document: *
C51 = Capacitor: Manufacturer: Murata; Model: GRM219R71H334KA88D; Value: 0,33мкФ; Document: *
C54 = Capacitor_Polar: Model: TECAP, 10 мкФ, 25 В, тип B, 10%; Value: 10мкФх25B; Document: *; Manufacturer: *
DA7 = LMC7101: Manufacturer: Texas Instruments; Model: LMC7101BIM5; Document: *
DA8 = LD2981ABU50TR: Manufacturer: STMicroelectronics; Model: L78L05ABUTR; Document: *
DD3 = ADUM1100: Manufacturer: Analog Devices; Model: ADUM1100BR; Document: *
DD4 = ADUM1200: Manufacturer: Analog Devices; Model: ADUM1200CR; Document: *
R21 = Resistor: as R6 on sheet Main; Value: 200; Document: *
R22-R24 = Resistor: as R5 on sheet Main; Value: 10к; Document: *
U1 = TLP291: Manufacturer: Toshiba; Model: TLP291(GB-TP,SE; Document: *
XP6 = Connector-8: Manufacturer: JST; Model: B8B-PHDSS; Document: *

## Sheet LD_driver.SchDoc
size 420 x 297 mm; Address1: Address1; Address2: Address2; Address3: Address3; Address4: Address4; DocumentNumber: *Э3; SheetNumber: 5; SheetTotal: 14; DocumentType: Схема электрическая *
Used 5 times, as channels A11, A12, A13, A14, A15. Parts and nets are listed once, with the designators drawn on the sheet.
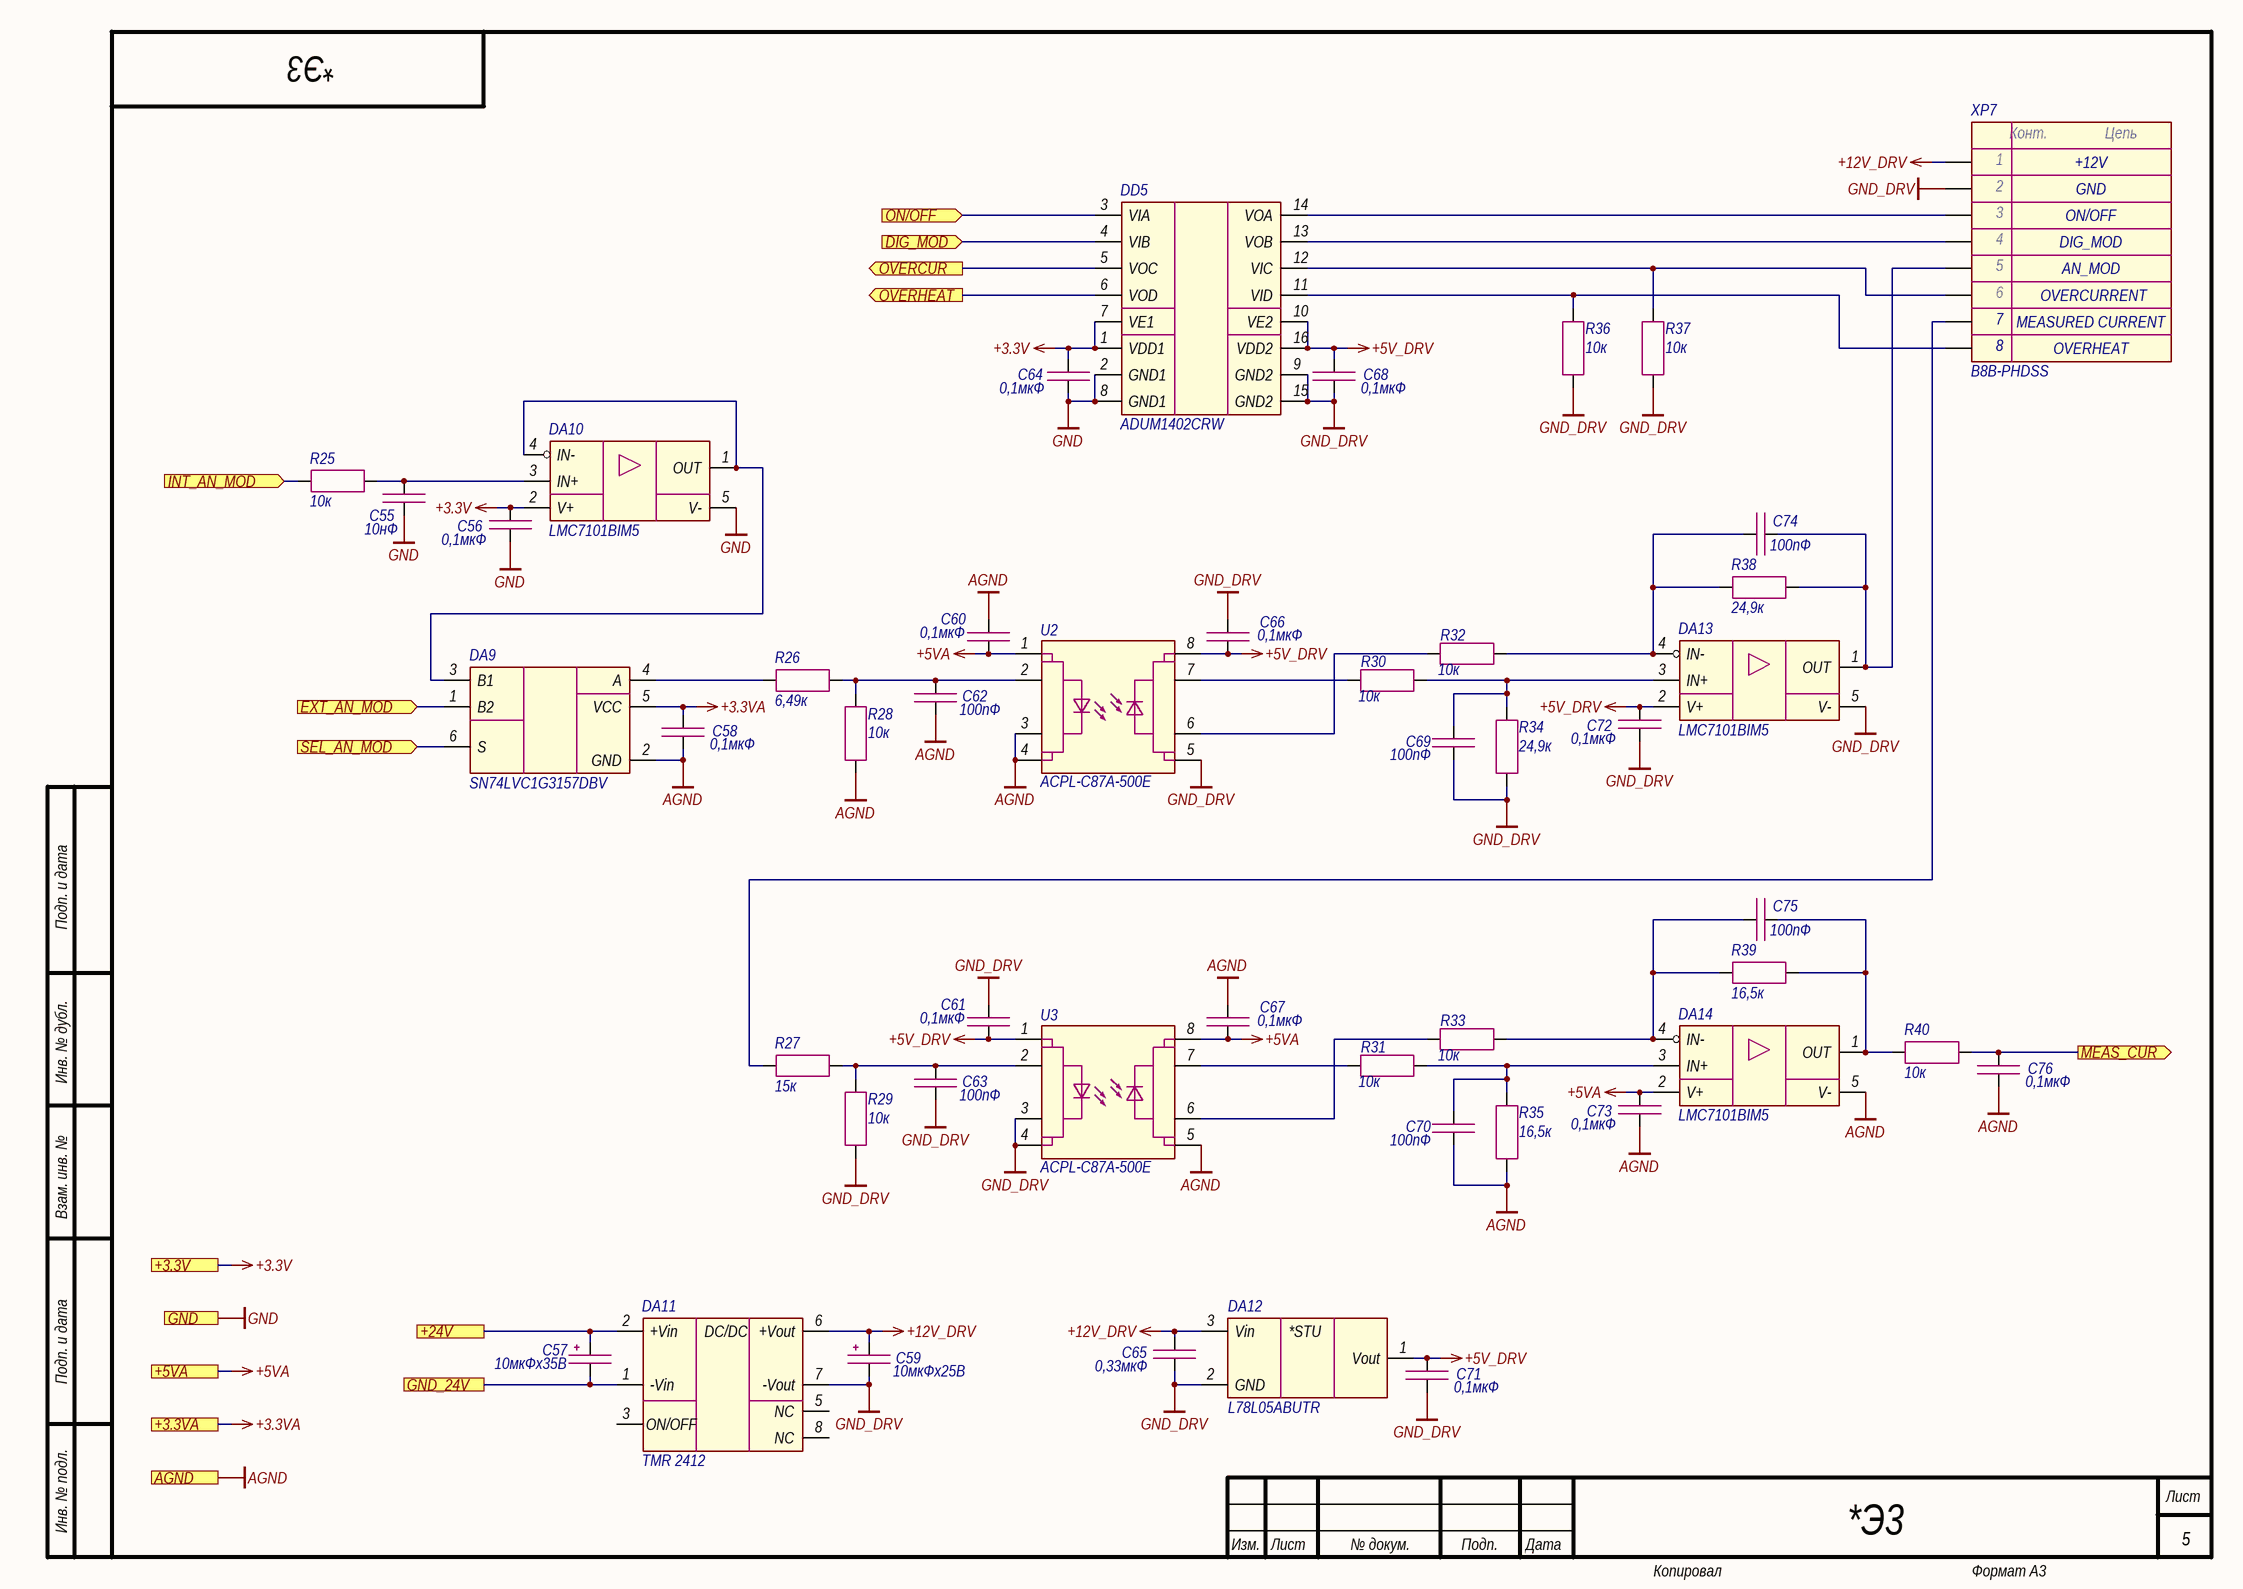
[diagram p4: LD_driver.SchDoc]

### Parts
C55  10нФ  [CAP_0603]
C56  0,1мкФ  [CAP_0603]
C57  10мкФх35B  [CAP_C]
C58  0,1мкФ  [CAP_0603]
C59  10мкФх25B  [CAP_B]
C60  0,1мкФ  [CAP_0603]
C61  0,1мкФ  [CAP_0603]
C62  100пФ  [CAP_0603]
C63  100пФ  [CAP_0603]
C64  0,1мкФ  [CAP_0603]
C65  0,33мкФ  [CAP_0805]
C66  0,1мкФ  [CAP_0603]
C67  0,1мкФ  [CAP_0603]
C68  0,1мкФ  [CAP_0603]
C69  100пФ  [CAP_0603]
C70  100пФ  [CAP_0603]
C71  0,1мкФ  [CAP_0603]
C72  0,1мкФ  [CAP_0603]
C73  0,1мкФ  [CAP_0603]
C74  100пФ  [CAP_0603]
C75  100пФ  [CAP_0603]
C76  0,1мкФ  [CAP_0603]
DA9  SN74LVC1G3157DBV  [SOT-23-6]
DA10  LMC7101BIM5  [SOT-23-5]
DA11  TMR 2412  [TMR3 (SIP-8)]
DA12  L78L05ABUTR  [SOT-89]
DA13  LMC7101BIM5  [SOT-23-5]
DA14  LMC7101BIM5  [SOT-23-5]
DD5  ADUM1402CRW  [SOIC-16W]
R25  10к  [RES_0603]
R26  6,49к  [RES_0603]
R27  15к  [RES_0603]
R28  10к  [RES_0603]
R29  10к  [RES_0603]
R30  10к  [RES_0603]
R31  10к  [RES_0603]
R32  10к  [RES_0603]
R33  10к  [RES_0603]
R34  24,9к  [RES_0603]
R35  16,5к  [RES_0603]
R36  10к  [RES_0603]
R37  10к  [RES_0603]
R38  24,9к  [RES_0603]
R39  16,5к  [RES_0603]
R40  10к  [RES_0603]
U2  ACPL-C87A-500E  [SSO-8]
U3  ACPL-C87A-500E  [SSO-8]
XP7  B8B-PHDSS  [B8B-PHDSS]

### Ports
+3.3V (see Main[2D], Button[1D], Ethernet[3D], Fiber_interlock[2C], Flow_sensor[2C], Power_supply[2C], RS-485[2C]), +3.3VA (see Main[2D], Photodiode[1C], Thermistor[2C]), +5VA (see Main[2D], Analog_isolation[2C], Photodiode[1C]), +24V (see Main[1D], Button[1C], Column[1C], Flow_sensor[2C], Indication[1C]), AGND (see Main[2D], Analog_isolation[2C], Photodiode[1D], Thermistor[2C]), DIG_MOD (in, see Main[1C]), EXT_AN_MOD (in, see Main[1D]), GND (see Main[2D], Button[1D], Column[1C], Ethernet[3D], Fiber_interlock[2C], Flow_sensor[2C], Guide_laser[1C], Indication[1C], Power_supply[2C], RS-485[2C]), GND_24V (see Main[1D], Button[1D], Column[1C], Flow_sensor[2C], Indication[1C]), INT_AN_MOD (in, see Main[1C]), MEAS_CUR (out, see Main[2C]), ON/OFF (in, see Main[1C]), OVERCUR (out, see Main[2C]), OVERHEAT (out, see Main[2C]), SEL_AN_MOD (in, see Main[1D])

### Nets
+3.3V: C56.1 C64.1 DA10.2(V+) DD5.1(VDD1) DD5.7(VE1) ; port +3.3V
+3.3VA: C58.1 DA9.5(VCC) ; port +3.3VA
+5V_DRV: C61.1 C66.1 C68.1 C71.1 C72.1 DA12.1(Vout) DA13.2(V+) DD5.10(VE2) DD5.16(VDD2) U2.8(VDD2) U3.1(VDD1)
+5VA: C60.1 C67.1 C73.1 DA14.2(V+) U2.1(VDD1) U3.8(VDD2) ; port +5VA
+12V_DRV: C59.1 C65.2 DA11.6(+Vout) DA12.3(Vin) XP7.1
AGND: C58.2 C60.2 C62.1 C67.2 C70.2 C73.2 C76.2 DA9.2(GND) DA14.5(V-) R28.2 R35.2 U2.3(SHDN) U2.4(GND1) U3.5(GND2) ; port AGND
GND: C55.2 C56.2 C64.2 DA10.5(V-) DD5.2(GND1) DD5.8(GND1) ; port GND
GND_DRV: C59.2 C61.2 C63.1 C65.1 C66.2 C68.2 C69.2 C71.2 C72.2 DA11.7(-Vout) DA12.2(GND) DA13.5(V-) DD5.9(GND2) DD5.15(GND2) R29.2 R34.1 R36.2 R37.2 U2.5(GND2) U3.3(SHDN) U3.4(GND1) XP7.2
+24V: C57.1 DA11.2(+Vin) ; port +24V
DIG_MOD: DD5.4(VIB) ; port DIG_MOD
EXT_AN_MOD: DA9.1(B2) ; port EXT_AN_MOD
GND_24V: C57.2 DA11.1(-Vin) ; port GND_24V
INT_AN_MOD: R25.1 ; port INT_AN_MOD
MEAS_CUR: C76.1 R40.2 ; port MEAS_CUR
ON/OFF: DD5.3(VIA) ; port ON/OFF
OVERCUR: DD5.5(VOC) ; port OVERCUR
OVERHEAT: DD5.6(VOD) ; port OVERHEAT
SEL_AN_MOD: DA9.6(S) ; port SEL_AN_MOD
NetC55_1: C55.1 DA10.3(IN+) R25.2
NetC62_2: C62.2 R26.1 R28.1 U2.2(VIN)
NetC63_2: C63.2 R27.1 R29.1 U3.2(VIN)
NetC69_1: C69.1 DA13.3(IN+) R30.2 R34.2
NetC70_1: C70.1 DA14.3(IN+) R31.2 R35.1
NetC74_1: C74.1 DA13.4(IN-) R32.2 R38.1
NetC74_2: C74.2 DA13.1(OUT) R38.2 XP7.5
NetC75_1: C75.1 DA14.4(IN-) R33.2 R39.2
NetC75_2: C75.2 DA14.1(OUT) R39.1 R40.1
NetDA9_3: DA9.3(B1) DA10.1(OUT) DA10.4(IN-)
NetDA9_4: DA9.4(A) R26.2
NetDD5_11: DD5.11(VID) R36.1 XP7.8
NetDD5_12: DD5.12(VIC) R37.1 XP7.6
NetDD5_13: DD5.13(VOB) XP7.4
NetDD5_14: DD5.14(VOA) XP7.3
NetR27_2: R27.2 XP7.7
NetR30_1: R30.1 U2.7(VOUT+)
NetR31_1: R31.1 U3.7(VOUT+)
NetR32_1: R32.1 U2.6(VOUT-)
NetR33_1: R33.1 U3.6(VOUT-)

Not connected (* = marked no-connect by the designer): DA11 3(ON/OFF) 5(NC) 8(NC)

### Channels
A11: designators end in A11; ports +3.3V=+3.3V +3.3VA=+3.3VA +5VA=+5VA +24V=+24V AGND=AGND DIG_MOD=DRV1_DIG_MOD EXT_AN_MOD=EXT1_AN_MOD GND=GND GND_24V=GND_24V INT_AN_MOD=DRV1_AN_MOD MEAS_CUR=DRV1_ADC ON/OFF=DRV1_ON OVERCUR=DRV1_ERR1 OVERHEAT=DRV1_ERR2 SEL_AN_MOD=DRV1_SEL_AN
A12: designators end in A12; ports +3.3V=+3.3V +3.3VA=+3.3VA +5VA=+5VA +24V=+24V AGND=AGND DIG_MOD=DRV2_DIG_MOD EXT_AN_MOD=EXT2_AN_MOD GND=GND GND_24V=GND_24V INT_AN_MOD=DRV2_AN_MOD MEAS_CUR=DRV2_ADC ON/OFF=DRV2_ON OVERCUR=DRV2_ERR1 OVERHEAT=DRV2_ERR2 SEL_AN_MOD=DRV2_SEL_AN
A13: designators end in A13; ports +3.3V=+3.3V +3.3VA=+3.3VA +5VA=+5VA +24V=+24V AGND=AGND DIG_MOD=DRV3_DIG_MOD EXT_AN_MOD=EXT3_AN_MOD GND=GND GND_24V=GND_24V INT_AN_MOD=DRV3_AN_MOD MEAS_CUR=DRV3_ADC ON/OFF=DRV3_ON OVERCUR=DRV3_ERR1 OVERHEAT=DRV3_ERR2 SEL_AN_MOD=DRV3_SEL_AN
A14: designators end in A14; ports +3.3V=+3.3V +3.3VA=+3.3VA +5VA=+5VA +24V=+24V AGND=AGND DIG_MOD=DRV4_DIG_MOD EXT_AN_MOD=EXT4_AN_MOD GND=GND GND_24V=GND_24V INT_AN_MOD=DRV4_AN_MOD MEAS_CUR=DRV4_ADC ON/OFF=DRV4_ON OVERCUR=DRV4_ERR1 OVERHEAT=DRV4_ERR2 SEL_AN_MOD=DRV4_SEL_AN
A15: designators end in A15; ports +3.3V=+3.3V +3.3VA=+3.3VA +5VA=+5VA +24V=+24V AGND=AGND DIG_MOD=DRV5_DIG_MOD EXT_AN_MOD=EXT5_AN_MOD GND=GND GND_24V=GND_24V INT_AN_MOD=DRV5_AN_MOD MEAS_CUR=DRV5_ADC ON/OFF=DRV5_ON OVERCUR=DRV5_ERR1 OVERHEAT=DRV5_ERR2 SEL_AN_MOD=DRV5_SEL_AN

### Notes on the sheet
- +12V
- GND
- ON/OFF
- DIG_MOD
- (near XP7) MEASURED CURRENT
- AN_MOD
- OVERCURRENT
- OVERHEAT
- Подп. и дата
- Инв. № дубл.
- Взам. инв. №
- Инв. № подл.
- Изм.
- Лист
- № докум.
- Подп.
- Дата
- Копировал
- Формат А3
- (in symbol Connector-8) Конт.; Цепь
- (in symbol LD2981ABU50TR) *STU
- (in symbol TMR3) DC/DC

### Library data of the parts
C55 = Capacitor: Manufacturer: Murata; Model: GRM188R71H103JA01D; Value: 10нФ; Document: *
C56 C58 C60 C61 C64 C66-C68 C71-C73 C76 = Capacitor: as C5 on sheet Main; Value: 0,1мкФ; Document: *
C57 = Capacitor_Polar: Model: TECAP, 10 мкФ, 35 В, тип C, 10%; Value: 10мкФх35B; Document: *; Manufacturer: *
C59 = Capacitor_Polar: Model: TECAP, 10 мкФ, 25 В, тип B, 10%; Value: 10мкФх25B; Document: *; Manufacturer: *
C62 C63 C69 C70 C74 C75 = Capacitor: Manufacturer: Murata; Model: GRM1885C1H101JA01D; Value: 100пФ; Document: *
C65 = Capacitor: as C51 on sheet Power_supply; Value: 0,33мкФ; Document: *
DA9 = SN74LVC1G3157: Manufacturer: Texas Instruments; Model: SN74LVC1G3157DBV; Document: *
DA10 DA13 DA14 = LMC7101: Manufacturer: Texas Instruments; Model: LMC7101BIM5; Document: *
DA11 = TMR3: Manufacturer: Traco Power; Model: TMR 2412; Document: *
DA12 = LD2981ABU50TR: Manufacturer: STMicroelectronics; Model: L78L05ABUTR; Document: *
DD5 = ADUM1402: Manufacturer: Analog Devices; Model: ADUM1402CRW; Document: *
R25 R28-R33 R36 R37 R40 = Resistor: as R5 on sheet Main; Value: 10к; Document: *
R26 = Resistor: Manufacturer: Yageo; Model: RC0603FR-076K49L; Value: 6,49к; Document: *
R27 = Resistor: Manufacturer: Yageo; Model: RC0603FR-0715KL; Value: 15к; Document: *
R34 R38 = Resistor: Manufacturer: Yageo; Model: RC0603FR-0724K9L; Value: 24,9к; Document: *
R35 R39 = Resistor: Manufacturer: Yageo; Model: RC0603FR-0716K5L; Value: 16,5к; Document: *
U2 U3 = ACPL-C87: Manufacturer: Broadcom; Model: ACPL-C87A-500E
XP7 = Connector-8: Manufacturer: JST; Model: B8B-PHDSS; Document: *

## Sheet Guide_laser.SchDoc
size 420 x 297 mm; Address1: Address1; Address2: Address2; Address3: Address3; Address4: Address4; DocumentNumber: *Э3; SheetNumber: 6; SheetTotal: 14; DocumentType: Схема электрическая *
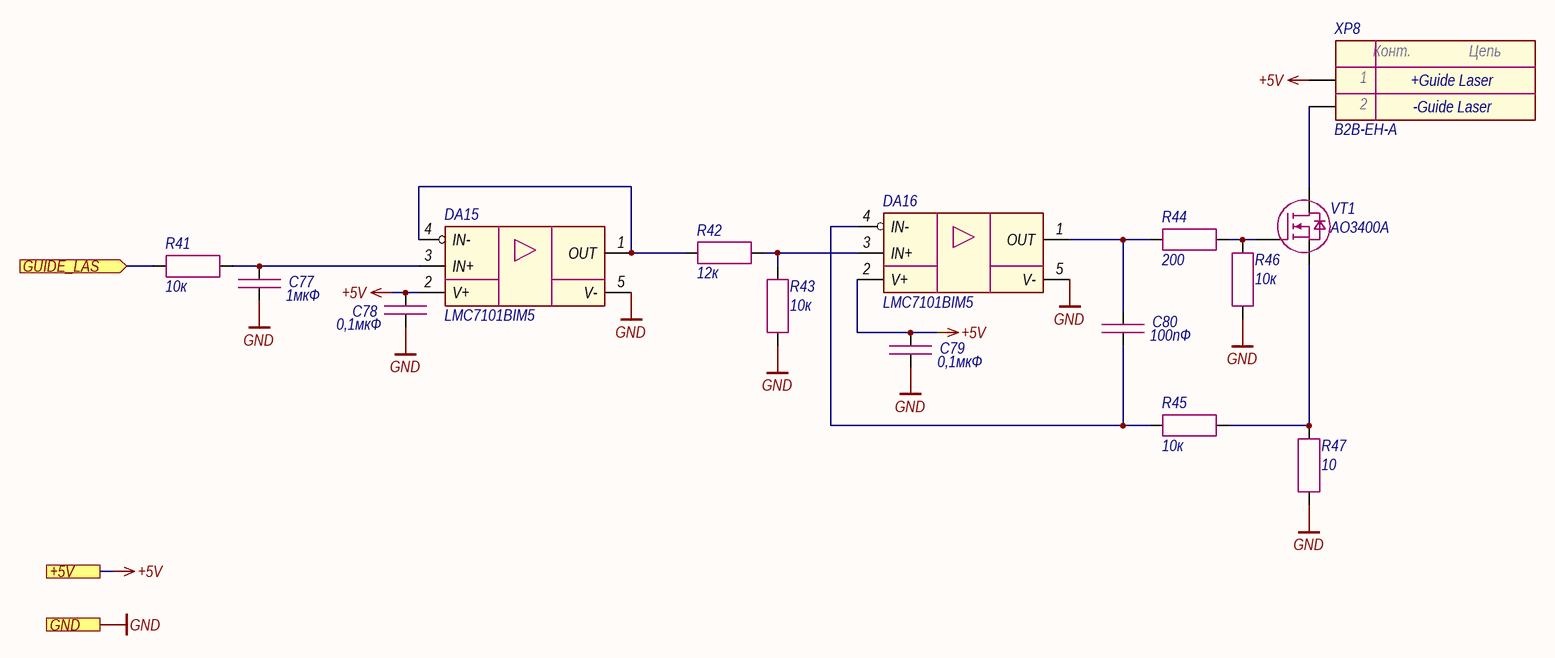
[diagram p5: Guide_laser.SchDoc]

### Parts
C77  1мкФ  [CAP_0603]
C78  0,1мкФ  [CAP_0603]
C79  0,1мкФ  [CAP_0603]
C80  100пФ  [CAP_0603]
DA15  LMC7101BIM5  [SOT-23-5]
DA16  LMC7101BIM5  [SOT-23-5]
R41  10к  [RES_0603]
R42  12к  [RES_0603]
R43  10к  [RES_0603]
R44  200  [RES_0603]
R45  10к  [RES_0603]
R46  10к  [RES_0603]
R47  10  [RES_1210]
VT1  AO3400A  [SOT-23-3]
XP8  B2B-EH-A  [B2B-EH-A]

### Ports
+5V (see Main[2C]), GND (see Main[2C], Button[1D], Column[1C], Ethernet[3D], Fiber_interlock[2C], Flow_sensor[2C], Indication[1C], LD_driver[1D], Power_supply[2C], RS-485[2C]), GUIDE_LAS (in, see Main[2C])

### Nets
+5V: C78.1 C79.1 DA15.2(V+) DA16.2(V+) XP8.1 ; port +5V
GND: C77.2 C78.2 C79.2 DA15.5(V-) DA16.5(V-) R43.2 R46.1 R47.1 ; port GND
GUIDE_LAS: R41.1 ; port GUIDE_LAS
NetC77_1: C77.1 DA15.3(IN+) R41.2
NetC80_1: C80.1 DA16.1(OUT) R44.1
NetC80_2: C80.2 DA16.4(IN-) R45.1
NetDA15_1: DA15.1(OUT) DA15.4(IN-) R42.1
NetDA16_3: DA16.3(IN+) R42.2 R43.1
NetR44_2: R44.2 R46.2 VT1.1(G)
NetR45_2: R45.2 R47.2 VT1.2(S)
NetVT1_3: VT1.3(D) XP8.2

### Notes on the sheet
- +Guide Laser
- -Guide Laser
- Подп. и дата
- Инв. № дубл.
- Взам. инв. №
- Инв. № подл.
- Изм.
- Лист
- № докум.
- Подп.
- Дата
- Копировал
- Формат А3
- (in symbol Connector-2) Конт.; Цепь

### Library data of the parts
C77 = Capacitor: as C9 on sheet Main; Value: 1мкФ; Document: *
C78 C79 = Capacitor: as C5 on sheet Main; Value: 0,1мкФ; Document: *
C80 = Capacitor: as C62 on sheet LD_driver; Value: 100пФ; Document: *
DA15 DA16 = LMC7101: Manufacturer: Texas Instruments; Model: LMC7101BIM5; Document: *
R41 R43 R45 R46 = Resistor: as R5 on sheet Main; Value: 10к; Document: *
R42 = Resistor: Manufacturer: Yageo; Model: RC0603FR-0712KL; Value: 12к; Document: *
R44 = Resistor: as R6 on sheet Main; Value: 200; Document: *
R47 = Resistor: Manufacturer: Yageo; Model: RC1210FR-0710RL; Value: 10; Document: *
VT1 = MOSFET N-channel: Manufacturer: UMW; Model: AO3400A; Document: *
XP8 = Connector-2: Manufacturer: JST; Model: B2B-EH-A; Document: *

## Sheet Indication.SchDoc
size 420 x 297 mm; Address1: Address1; Address2: Address2; Address3: Address3; Address4: Address4; DocumentNumber: *Э3; SheetNumber: 7; SheetTotal: 14; DocumentType: Схема электрическая *
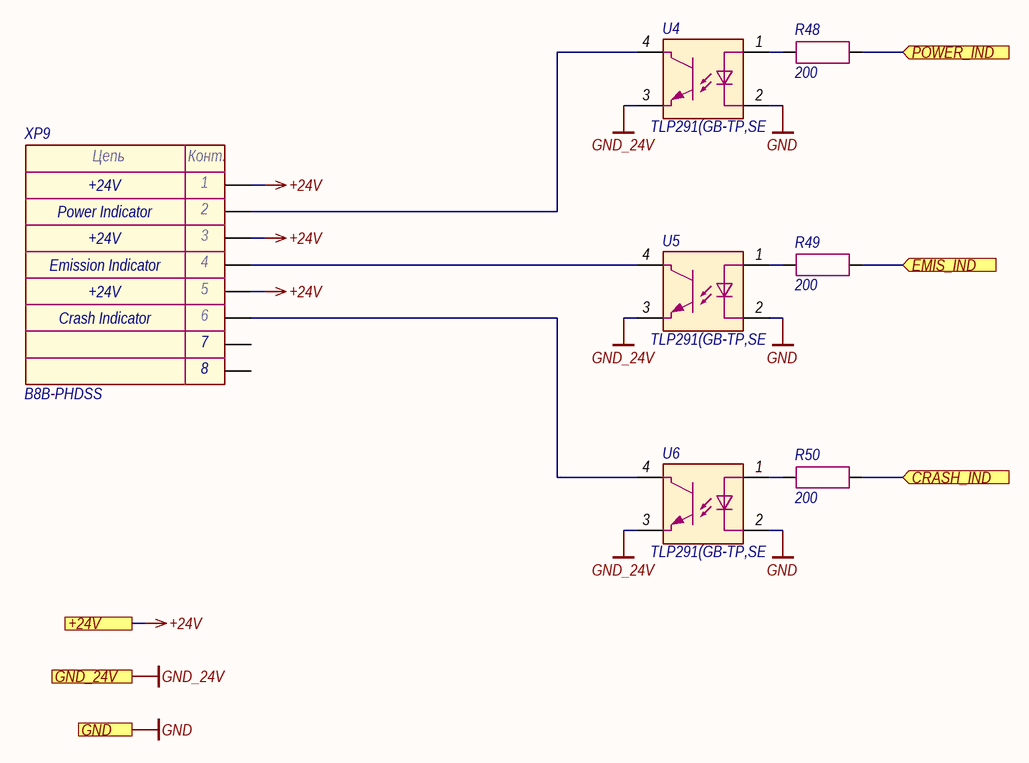
[diagram p6: Indication.SchDoc]

### Parts
R48  200  [RES_0603]
R49  200  [RES_0603]
R50  200  [RES_0603]
U4  TLP291(GB-TP,SE  [11-3C1]
U5  TLP291(GB-TP,SE  [11-3C1]
U6  TLP291(GB-TP,SE  [11-3C1]
XP9  B8B-PHDSS  [B8B-PHDSS]

### Ports
+24V (see Main[2C], Button[1C], Column[1C], Flow_sensor[2C], LD_driver[1D]), CRASH_IND (in, see Main[2C]), EMIS_IND (in, see Main[2C]), GND (see Main[2C], Button[1D], Column[1C], Ethernet[3D], Fiber_interlock[2C], Flow_sensor[2C], Guide_laser[1C], LD_driver[1D], Power_supply[2C], RS-485[2C]), GND_24V (see Main[2C], Button[1D], Column[1C], Flow_sensor[2C], LD_driver[1D]), POWER_IND (in, see Main[2C])

### Nets
+24V: XP9.1 XP9.3 XP9.5 ; port +24V
GND: U4.2 U5.2 U6.2 ; port GND
GND_24V: U4.3 U5.3 U6.3 ; port GND_24V
CRASH_IND: R50.2 ; port CRASH_IND
EMIS_IND: R49.2 ; port EMIS_IND
POWER_IND: R48.2 ; port POWER_IND
NetR48_1: R48.1 U4.1
NetR49_1: R49.1 U5.1
NetR50_1: R50.1 U6.1
NetU4_4: U4.4 XP9.2
NetU5_4: U5.4 XP9.4
NetU6_4: U6.4 XP9.6

Not connected (* = marked no-connect by the designer): XP9 7 8

### Notes on the sheet
- Power Indicator
- +24V
- (near XP9) Emission Indicator
- Crash Indicator
- Подп. и дата
- Инв. № дубл.
- Взам. инв. №
- Инв. № подл.
- Изм.
- Лист
- № докум.
- Подп.
- Дата
- Копировал
- Формат А3
- (in symbol Connector-8) Цепь; Конт.

### Library data of the parts
R48-R50 = Resistor: as R6 on sheet Main; Value: 200; Document: *
U4-U6 = TLP291: Manufacturer: Toshiba; Model: TLP291(GB-TP,SE; Document: *
XP9 = Connector-8: Manufacturer: JST; Model: B8B-PHDSS; Document: *

## Sheet Column.SchDoc
size 420 x 297 mm; Address1: Address1; Address2: Address2; Address3: Address3; Address4: Address4; DocumentNumber: *Э3; SheetNumber: 8; SheetTotal: 14; DocumentType: Схема электрическая *
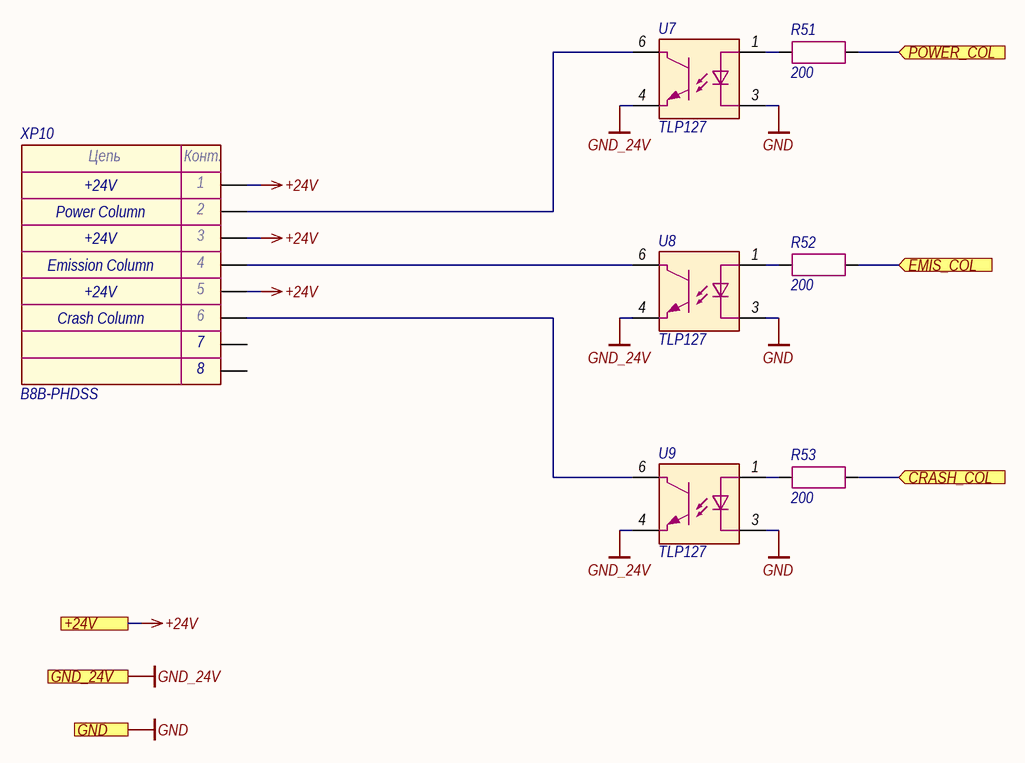
[diagram p7: Column.SchDoc]

### Parts
R51  200  [RES_0603]
R52  200  [RES_0603]
R53  200  [RES_0603]
U7  TLP127  [11-4C1]
U8  TLP127  [11-4C1]
U9  TLP127  [11-4C1]
XP10  B8B-PHDSS  [B8B-PHDSS]

### Ports
+24V (see Main[2C], Button[1C], Flow_sensor[2C], Indication[1C], LD_driver[1D]), CRASH_COL (in, see Main[2C]), EMIS_COL (in, see Main[2C]), GND (see Main[2C], Button[1D], Ethernet[3D], Fiber_interlock[2C], Flow_sensor[2C], Guide_laser[1C], Indication[1C], LD_driver[1D], Power_supply[2C], RS-485[2C]), GND_24V (see Main[2C], Button[1D], Flow_sensor[2C], Indication[1C], LD_driver[1D]), POWER_COL (in, see Main[2C])

### Nets
+24V: XP10.1 XP10.3 XP10.5 ; port +24V
GND: U7.3 U8.3 U9.3 ; port GND
GND_24V: U7.4 U8.4 U9.4 ; port GND_24V
CRASH_COL: R53.2 ; port CRASH_COL
EMIS_COL: R52.2 ; port EMIS_COL
POWER_COL: R51.2 ; port POWER_COL
NetR51_1: R51.1 U7.1
NetR52_1: R52.1 U8.1
NetR53_1: R53.1 U9.1
NetU7_6: U7.6 XP10.2
NetU8_6: U8.6 XP10.4
NetU9_6: U9.6 XP10.6

Not connected (* = marked no-connect by the designer): XP10 7 8

### Notes on the sheet
- Power Column
- +24V
- Emission Column
- Crash Column
- Подп. и дата
- Инв. № дубл.
- Взам. инв. №
- Инв. № подл.
- Изм.
- Лист
- № докум.
- Подп.
- Дата
- Копировал
- Формат А3
- (in symbol Connector-8) Цепь; Конт.

### Library data of the parts
R51-R53 = Resistor: as R6 on sheet Main; Value: 200; Document: *
U7-U9 = TLP127: Manufacturer: Toshiba; Model: TLP127; Document: *
XP10 = Connector-8: Manufacturer: JST; Model: B8B-PHDSS; Document: *

## Sheet Button.SchDoc
size 420 x 297 mm; Address1: Address1; Address2: Address2; Address3: Address3; Address4: Address4; DocumentNumber: *Э3; SheetNumber: 9; SheetTotal: 14; DocumentType: Схема электрическая *
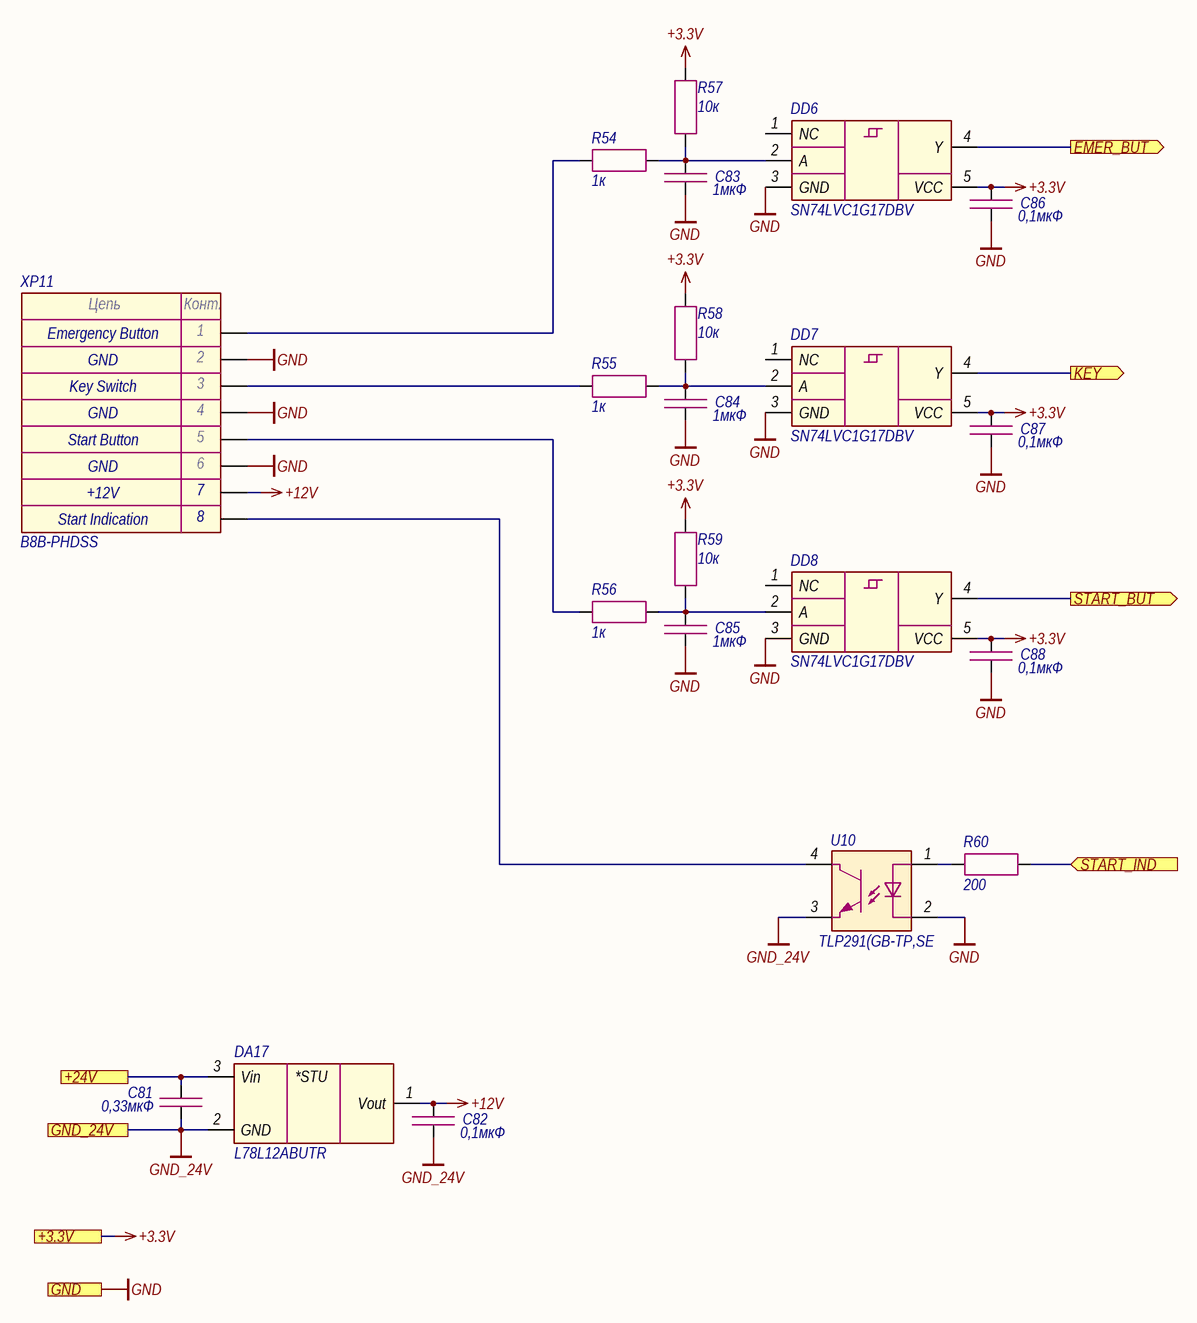
[diagram p8: Button.SchDoc]

### Parts
C81  0,33мкФ  [CAP_0805]
C82  0,1мкФ  [CAP_0603]
C83  1мкФ  [CAP_0603]
C84  1мкФ  [CAP_0603]
C85  1мкФ  [CAP_0603]
C86  0,1мкФ  [CAP_0603]
C87  0,1мкФ  [CAP_0603]
C88  0,1мкФ  [CAP_0603]
DA17  L78L12ABUTR  [SOT-89]
DD6  SN74LVC1G17DBV  [SOT-23-5]
DD7  SN74LVC1G17DBV  [SOT-23-5]
DD8  SN74LVC1G17DBV  [SOT-23-5]
R54  1к  [RES_0603]
R55  1к  [RES_0603]
R56  1к  [RES_0603]
R57  10к  [RES_0603]
R58  10к  [RES_0603]
R59  10к  [RES_0603]
R60  200  [RES_0603]
U10  TLP291(GB-TP,SE  [11-3C1]
XP11  B8B-PHDSS  [B8B-PHDSS]

### Ports
+3.3V (see Main[2C], Ethernet[3D], Fiber_interlock[2C], Flow_sensor[2C], LD_driver[1D], Power_supply[2C], RS-485[2C]), +24V (see Main[2C], Column[1C], Flow_sensor[2C], Indication[1C], LD_driver[1D]), EMER_BUT (out, see Main[2C]), GND (see Main[2C], Column[1C], Ethernet[3D], Fiber_interlock[2C], Flow_sensor[2C], Guide_laser[1C], Indication[1C], LD_driver[1D], Power_supply[2C], RS-485[2C]), GND_24V (see Main[2C], Column[1C], Flow_sensor[2C], Indication[1C], LD_driver[1D]), KEY (out, see Main[2C]), START_BUT (out, see Main[2C]), START_IND (in, see Main[2C])

### Nets
+3.3V: C86.1 C87.1 C88.1 DD6.5(VCC) DD7.5(VCC) DD8.5(VCC) R57.2 R58.2 R59.2 ; port +3.3V
+12V: C82.1 DA17.1(Vout) XP11.7
+24V: C81.2 DA17.3(Vin) ; port +24V
GND: C83.2 C84.2 C85.2 C86.2 C87.2 C88.2 DD6.3(GND) DD7.3(GND) DD8.3(GND) U10.2 XP11.2 XP11.4 XP11.6 ; port GND
GND_24V: C81.1 C82.2 DA17.2(GND) U10.3 ; port GND_24V
EMER_BUT: DD6.4(Y) ; port EMER_BUT
KEY: DD7.4(Y) ; port KEY
START_BUT: DD8.4(Y) ; port START_BUT
START_IND: R60.2 ; port START_IND
NetC83_1: C83.1 DD6.2(A) R54.2 R57.1
NetC84_1: C84.1 DD7.2(A) R55.2 R58.1
NetC85_1: C85.1 DD8.2(A) R56.2 R59.1
NetR54_1: R54.1 XP11.1
NetR55_1: R55.1 XP11.3
NetR56_1: R56.1 XP11.5
NetR60_1: R60.1 U10.1
NetU10_4: U10.4 XP11.8

Not connected (* = marked no-connect by the designer): DD6 1(NC); DD7 1(NC); DD8 1(NC)

### Notes on the sheet
- GND
- (near XP11) Emergency Button
- Start Button
- Key Switch
- +12V
- (near XP11) Start Indication
- Подп. и дата
- Инв. № дубл.
- Взам. инв. №
- Инв. № подл.
- Изм.
- Лист
- № докум.
- Подп.
- Дата
- Копировал
- Формат А3
- (in symbol Connector-8) Цепь; Конт.
- (in symbol LD2981ABU50TR) *STU

### Library data of the parts
C81 = Capacitor: as C51 on sheet Power_supply; Value: 0,33мкФ; Document: *
C82 C86-C88 = Capacitor: as C5 on sheet Main; Value: 0,1мкФ; Document: *
C83-C85 = Capacitor: as C9 on sheet Main; Value: 1мкФ; Document: *
DA17 = LD2981ABU50TR: Manufacturer: STMicroelectronics; Model: L78L12ABUTR; Document: *
DD6-DD8 = SN74LVC1G17: Manufacturer: Texas Instruments; Model: SN74LVC1G17DBV; Document: *
R54-R56 = Resistor: Manufacturer: Yageo; Model: RC0603FR-071KL; Value: 1к; Document: *
R57-R59 = Resistor: as R5 on sheet Main; Value: 10к; Document: *
R60 = Resistor: as R6 on sheet Main; Value: 200; Document: *
U10 = TLP291: Manufacturer: Toshiba; Model: TLP291(GB-TP,SE; Document: *
XP11 = Connector-8: Manufacturer: JST; Model: B8B-PHDSS; Document: *

## Sheet Fiber_interlock.SchDoc
size 420 x 297 mm; Address1: Address1; Address2: Address2; Address3: Address3; Address4: Address4; DocumentNumber: *Э3; SheetNumber: 10; SheetTotal: 14; DocumentType: Схема электрическая *
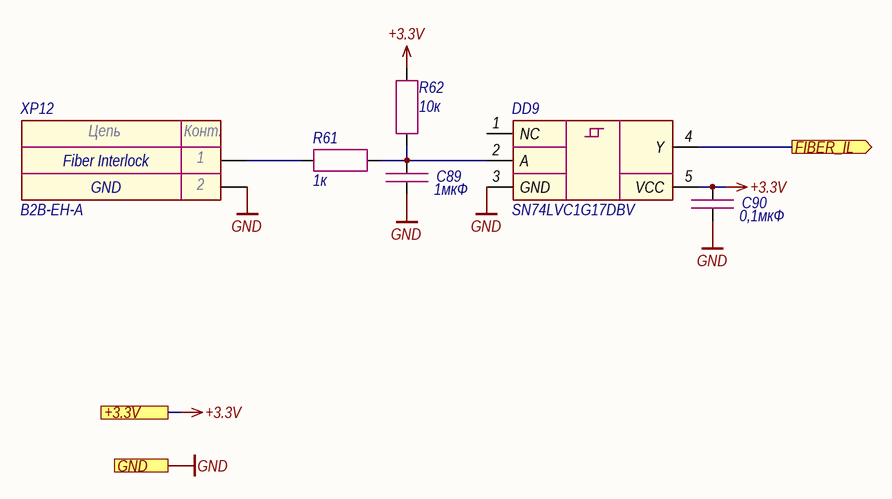
[diagram p9: Fiber_interlock.SchDoc]

### Parts
C89  1мкФ  [CAP_0603]
C90  0,1мкФ  [CAP_0603]
DD9  SN74LVC1G17DBV  [SOT-23-5]
R61  1к  [RES_0603]
R62  10к  [RES_0603]
XP12  B2B-EH-A  [B2B-EH-A]

### Ports
+3.3V (see Main[2D], Button[1D], Ethernet[3D], Flow_sensor[2C], LD_driver[1D], Power_supply[2C], RS-485[2C]), FIBER_IL (out, see Main[2D]), GND (see Main[2D], Button[1D], Column[1C], Ethernet[3D], Flow_sensor[2C], Guide_laser[1C], Indication[1C], LD_driver[1D], Power_supply[2C], RS-485[2C])

### Nets
+3.3V: C90.1 DD9.5(VCC) R62.2 ; port +3.3V
GND: C89.2 C90.2 DD9.3(GND) XP12.2 ; port GND
FIBER_IL: DD9.4(Y) ; port FIBER_IL
NetC89_1: C89.1 DD9.2(A) R61.2 R62.1
NetR61_1: R61.1 XP12.1

Not connected (* = marked no-connect by the designer): DD9 1(NC)

### Notes on the sheet
- (near XP12) Fiber Interlock
- GND
- Подп. и дата
- Инв. № дубл.
- Взам. инв. №
- Инв. № подл.
- Изм.
- Лист
- № докум.
- Подп.
- Дата
- Копировал
- Формат А3
- (in symbol Connector-2) Цепь; Конт.

### Library data of the parts
C89 = Capacitor: as C9 on sheet Main; Value: 1мкФ; Document: *
C90 = Capacitor: as C5 on sheet Main; Value: 0,1мкФ; Document: *
DD9 = SN74LVC1G17: Manufacturer: Texas Instruments; Model: SN74LVC1G17DBV; Document: *
R61 = Resistor: as R54 on sheet Button; Value: 1к; Document: *
R62 = Resistor: as R5 on sheet Main; Value: 10к; Document: *
XP12 = Connector-2: Manufacturer: JST; Model: B2B-EH-A; Document: *

## Sheet Flow_sensor.SchDoc
size 420 x 297 mm; Address1: Address1; Address2: Address2; Address3: Address3; Address4: Address4; DocumentNumber: *Э3; SheetNumber: 11; SheetTotal: 14; DocumentType: Схема электрическая *
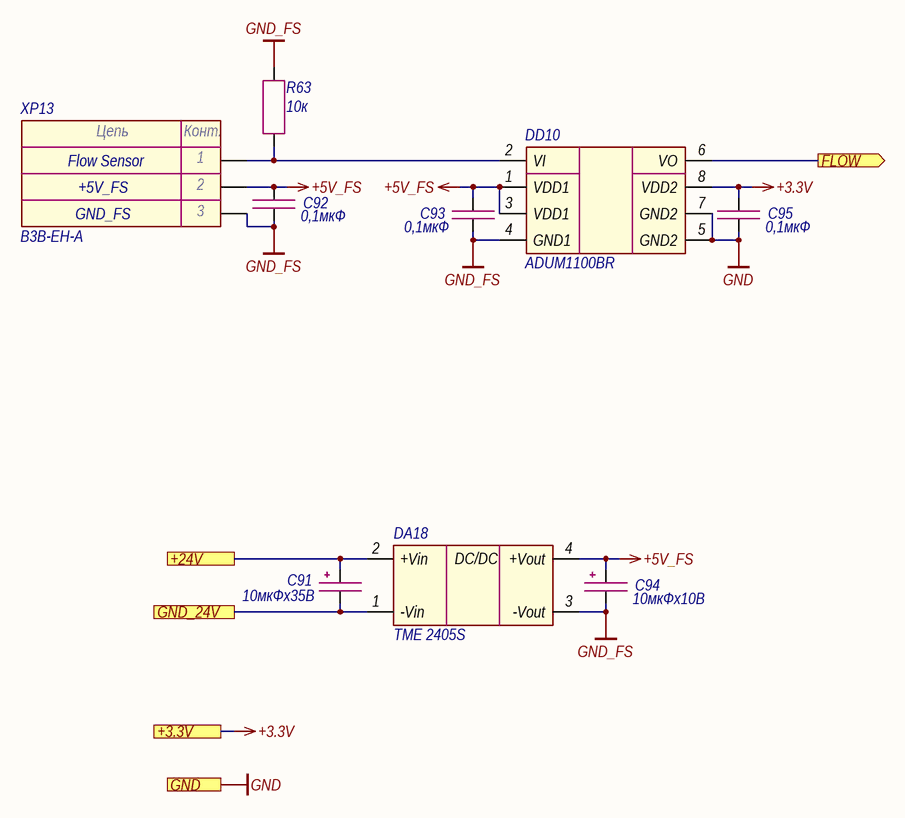
[diagram p10: Flow_sensor.SchDoc]

### Parts
C91  10мкФх35B  [CAP_C]
C92  0,1мкФ  [CAP_0603]
C93  0,1мкФ  [CAP_0603]
C94  10мкФх10B  [CAP_A]
C95  0,1мкФ  [CAP_0603]
DA18  TME 2405S  [TME (SIP-4)]
DD10  ADUM1100BR  [SOIC-8]
R63  10к  [RES_0603]
XP13  B3B-EH-A  [B3B-EH-A]

### Ports
+3.3V (see Main[1C], Button[1D], Ethernet[3D], Fiber_interlock[2C], LD_driver[1D], Power_supply[2C], RS-485[2C]), +24V (see Main[1C], Button[1C], Column[1C], Indication[1C], LD_driver[1D]), FLOW (out, see Main[1C]), GND (see Main[1C], Button[1D], Column[1C], Ethernet[3D], Fiber_interlock[2C], Guide_laser[1C], Indication[1C], LD_driver[1D], Power_supply[2C], RS-485[2C]), GND_24V (see Main[1C], Button[1D], Column[1C], Indication[1C], LD_driver[1D])

### Nets
+3.3V: C95.1 DD10.8(VDD2) ; port +3.3V
+5V_FS: C92.1 C93.1 C94.1 DA18.4(+Vout) DD10.1(VDD1) DD10.3(VDD1) XP13.2
+24V: C91.1 DA18.2(+Vin) ; port +24V
GND: C95.2 DD10.5(GND2) DD10.7(GND2) ; port GND
GND_24V: C91.2 DA18.1(-Vin) ; port GND_24V
GND_FS: C92.2 C93.2 C94.2 DA18.3(-Vout) DD10.4(GND1) R63.2 XP13.3
FLOW: DD10.6(VO) ; port FLOW
NetDD10_2: DD10.2(VI) R63.1 XP13.1

### Notes on the sheet
- +5V_FS
- Flow Sensor
- GND_FS
- Подп. и дата
- Инв. № дубл.
- Взам. инв. №
- Инв. № подл.
- Изм.
- Лист
- № докум.
- Подп.
- Дата
- Копировал
- Формат А3
- (in symbol Connector-3) Цепь; Конт.
- (in symbol TME) DC/DC

### Library data of the parts
C91 = Capacitor_Polar: Model: TECAP, 10 мкФ, 35 В, тип C, 10%; Value: 10мкФх35B; Document: *; Manufacturer: *
C92 C93 C95 = Capacitor: as C5 on sheet Main; Value: 0,1мкФ; Document: *
C94 = Capacitor_Polar: Model: TECAP, 10 мкФ, 10 В, тип A, 10%; Value: 10мкФх10B; Document: *; Manufacturer: *
DA18 = TME: Manufacturer: Traco Power; Model: TME 2405S; Document: *
DD10 = ADUM1100: Manufacturer: Analog Devices; Model: ADUM1100BR; Document: *
R63 = Resistor: as R5 on sheet Main; Value: 10к; Document: *
XP13 = Connector-3: Manufacturer: JST; Model: B3B-EH-A; Document: *

## Sheet RS-485.SchDoc
size 420 x 297 mm; Address1: Address1; Address2: Address2; Address3: Address3; Address4: Address4; DocumentNumber: *Э*; SheetNumber: 12; SheetTotal: 14; DocumentType: Схема электрическая *
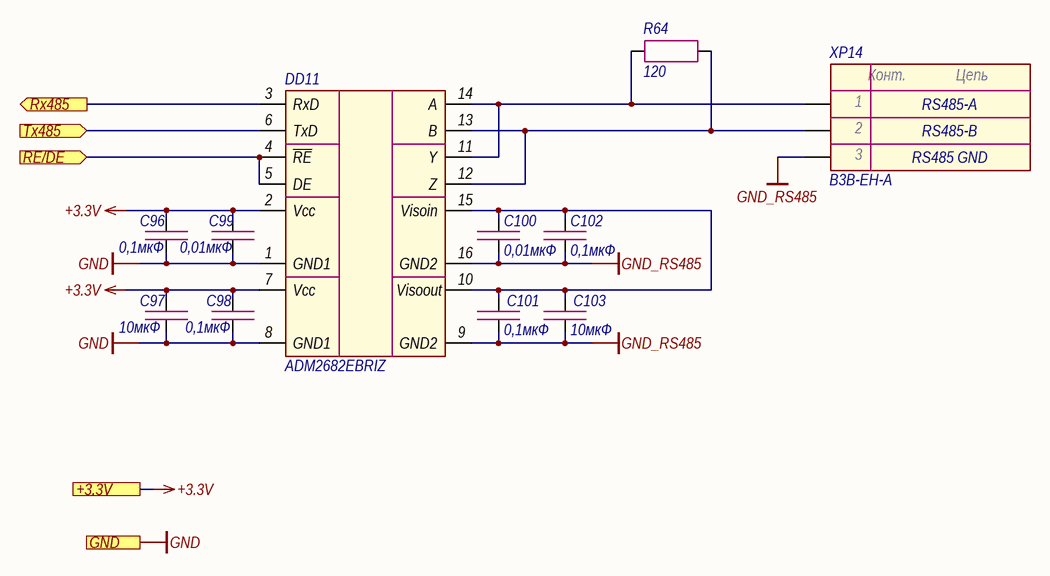
[diagram p11: RS-485.SchDoc]

### Parts
C96  0,1мкФ  [CAP_0603]
C97  10мкФ  [CAP_0603]
C98  0,1мкФ  [CAP_0603]
C99  0,01мкФ  [CAP_0603]
C100  0,01мкФ  [CAP_0603]
C101  0,1мкФ  [CAP_0603]
C102  0,1мкФ  [CAP_0603]
C103  10мкФ  [CAP_0603]
DD11  ADM2682EBRIZ  [SOIC-16IC]
R64  120  [RES_0603]
XP14  B3B-EH-A  [B3B-EH-A]

### Ports
+3.3V (see Main[1C], Button[1D], Ethernet[3D], Fiber_interlock[2C], Flow_sensor[2C], LD_driver[1D], Power_supply[2C]), GND (see Main[1C], Button[1D], Column[1C], Ethernet[3D], Fiber_interlock[2C], Flow_sensor[2C], Guide_laser[1C], Indication[1C], LD_driver[1D], Power_supply[2C]), RE/DE (in, see Main[1C]), Rx485 (out, see Main[1C]), Tx485 (in, see Main[1C])

### Nets
+3.3V: C96.1 C97.1 C98.1 C99.2 DD11.2(Vcc) DD11.7(Vcc) ; port +3.3V
GND: C96.2 C97.2 C98.2 C99.1 DD11.1(GND1) DD11.8(GND1) ; port GND
GND_RS485: C100.1 C101.2 C102.2 C103.2 DD11.9(GND2) DD11.16(GND2) XP14.3
RE/DE: DD11.4(~{RE}) DD11.5(DE) ; port RE/DE
Rx485: DD11.3(RxD) ; port Rx485
Tx485: DD11.6(TxD) ; port Tx485
NetC100_2: C100.2 C101.1 C102.1 C103.1 DD11.10(Visoout) DD11.15(Visoin)
NetDD11_11: DD11.11(Y) DD11.14(A) R64.1 XP14.1
NetDD11_12: DD11.12(Z) DD11.13(B) R64.2 XP14.2

### Notes on the sheet
- RS485-A
- RS485-B
- RS485 GND
- Подп. и дата
- Инв. № дубл.
- Взам. инв. №
- Инв. № подл.
- Изм.
- Лист
- № докум.
- Подп.
- Дата
- Копировал
- Формат А3
- (in symbol Connector-3) Конт.; Цепь

### Library data of the parts
C96 C98 C101 C102 = Capacitor: as C5 on sheet Main; Value: 0,1мкФ; Document: *
C97 C103 = Capacitor: as C8 on sheet Main; Value: 10мкФ; Document: *
C99 C100 = Capacitor: Manufacturer: Murata; Model: GRM188R71H103KA01D; Value: 0,01мкФ; Document: *
DD11 = ADM2682EBRIZ: Manufacturer: Analog Devices; Model: ADM2682EBRIZ; Document: *
R64 = Resistor: Manufacturer: Yageo; Model: RC0603FR-07120RL; Value: 120; Document: *
XP14 = Connector-3: Manufacturer: JST; Model: B3B-EH-A; Document: *